# EAGLE board nrfice (EAGLE 9.5.1), part 1 of 2
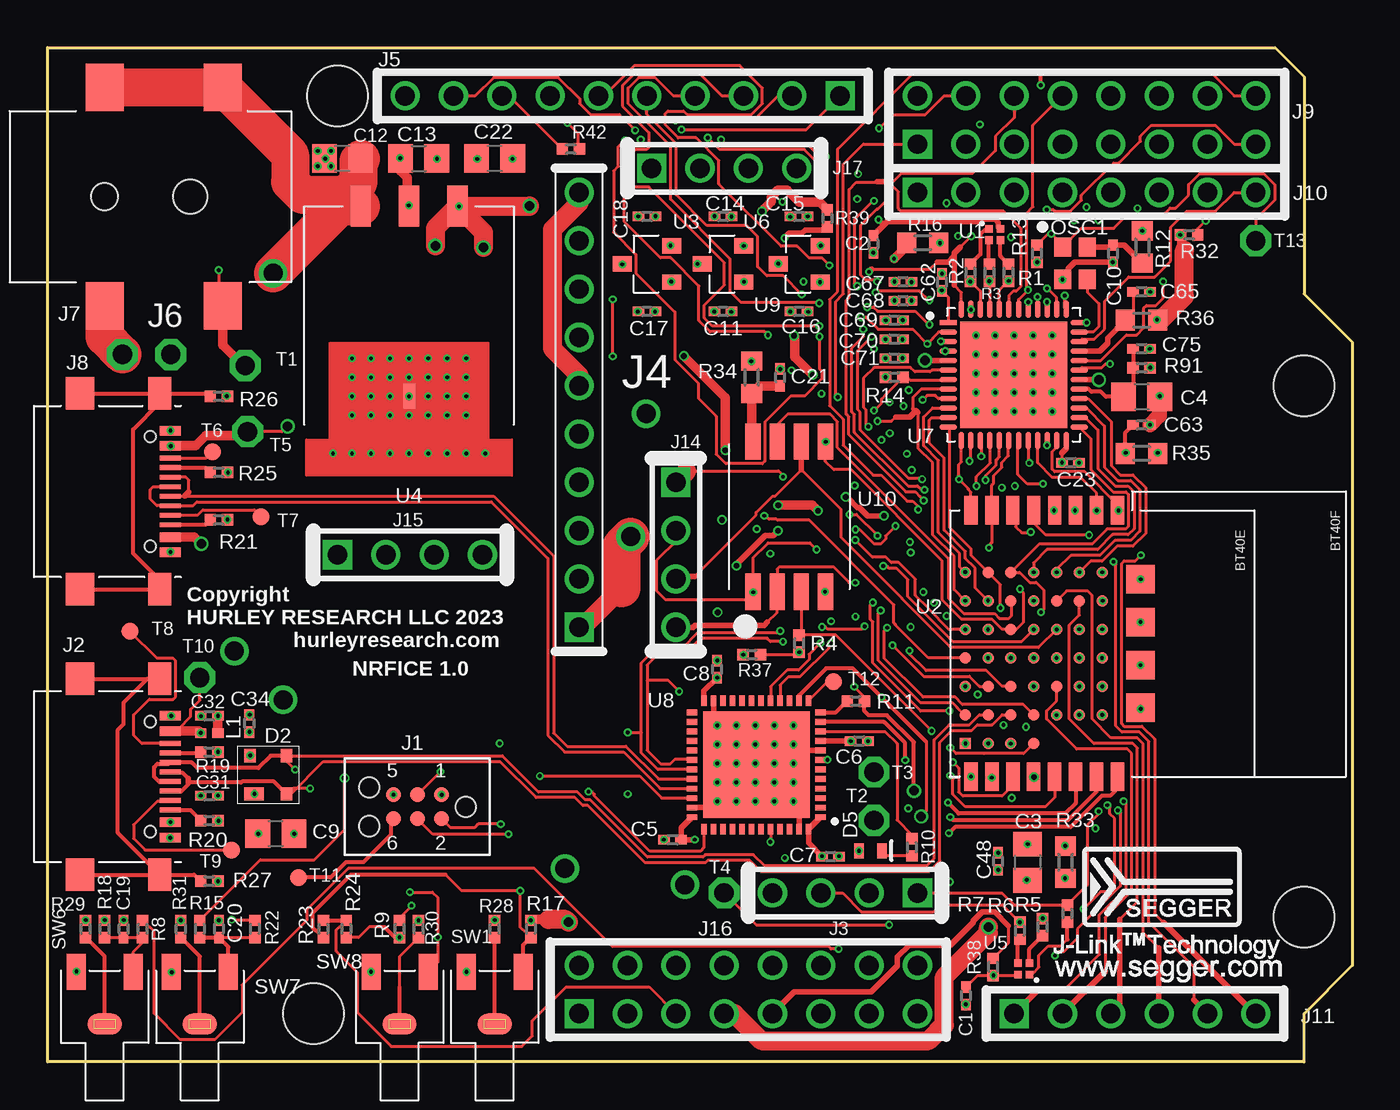
[diagram p4: board, top side]
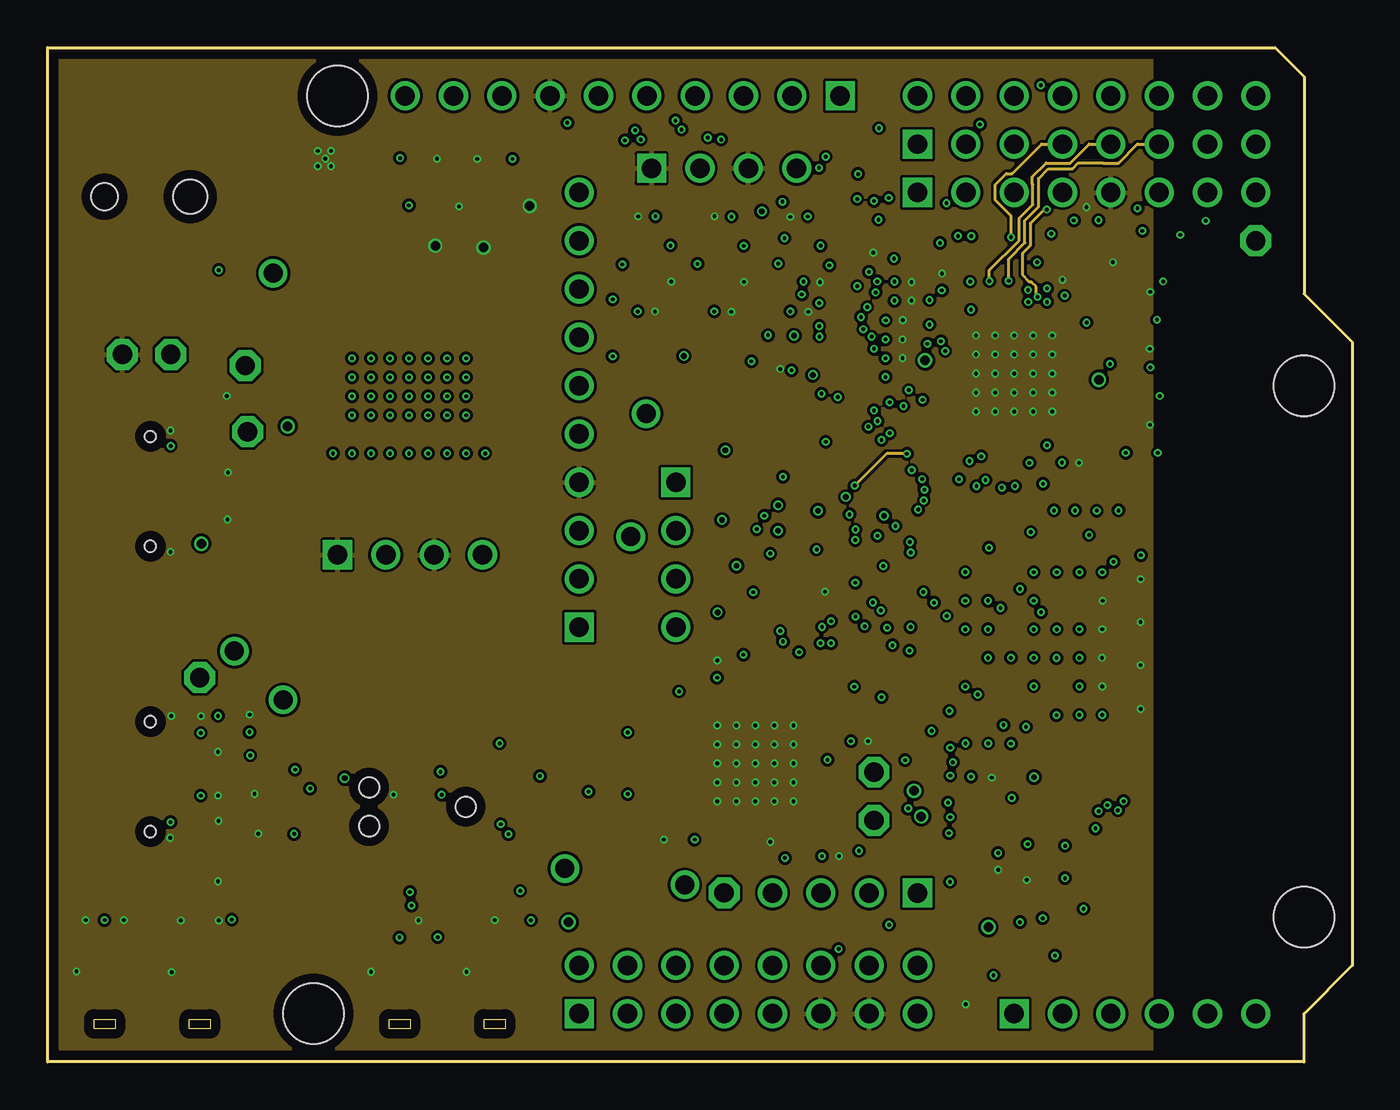
[diagram p5: board, inner layer gnd]
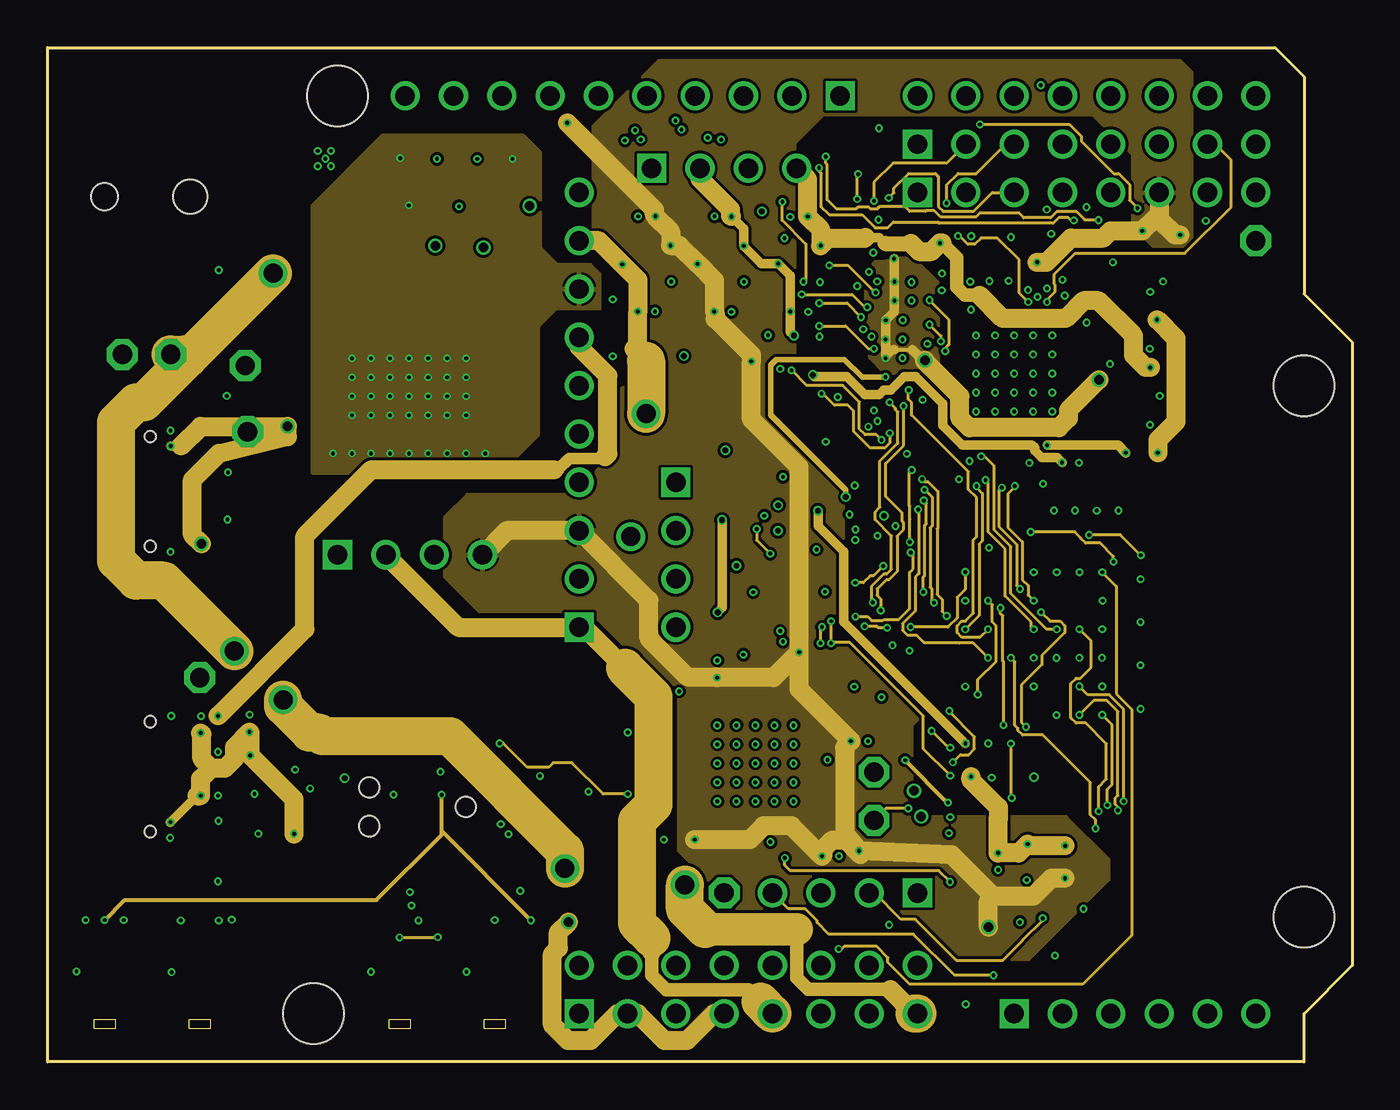
[diagram p6: board, inner layer Route15]
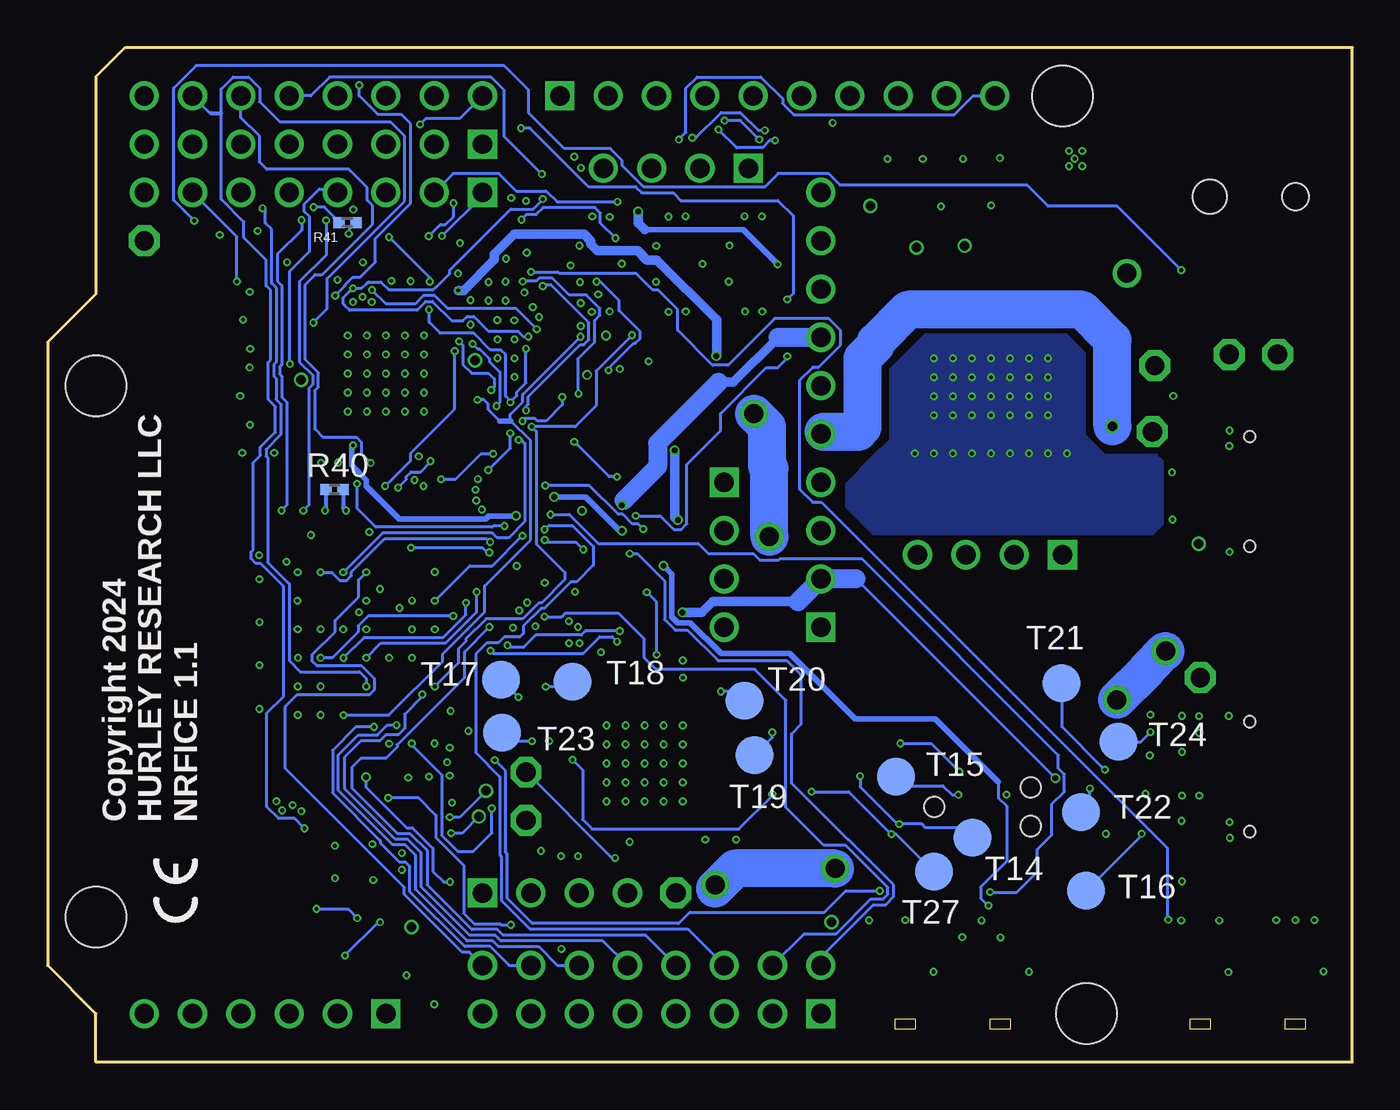
[diagram p7: board, bottom side, seen from below]

Size 68.58 x 53.34 mm. Coordinates in mm from the lower left corner, seen from the top.
Outline: 0,0 0,53.34 64.52,53.34 66.04,51.82 66.04,40.39 68.58,37.85 68.58,5.08 66.04,2.54 66.04,0 0,0
Copper layers (1*2*15*16): Top 0.035mm / dielectric 1.5mm / gnd 0.035mm / dielectric 0.15mm / Route15 0.035mm / dielectric 0.2mm / Bottom 0.035mm
Design rules "oid52840a *": minimum track width 0.15mm, minimum drill 0.2mm, track to track 0.15mm, track to pad 0.15mm, pad to pad 0.15mm, via to via 0.15mm, smd to smd 0mil, copper to edge 0.5mm, drill to drill 0.22mm, minimum pad ring 4mil, minimum via ring 4mil, stop-mask expansion 1mil, vias tented up to drill 15mil, thermal gap 5mil
Holes 3.17 mm at 15.24,50.8 13.97,2.54 66.04,7.62 66.04,35.56

## Footprints (pad centres in the part's own frame; a part is rotated, then mirrored left to right if it is on the bottom)
RCL_C0402 = smd 0.6 x 0.5: 1 -0.45,0; 2 0.45,0
RCL_C0805 = smd 1.3 x 1.5: 1 -0.95,0; 2 0.95,0
PRTR5V0U2X = smd 1 x 0.7: 1GND -0.75,-1 | smd 0.6 x 0.7: 2IO1 0.95,-1; 3IO2 0.95,1; 4VCC -0.95,1
XL-1608SYGC-06 = smd 0.5 x 0.8: A 0.6,0; C -0.6,0
JLINKNEEDLE6 = smd 0.787 x 0.787: 1VTREF 1.27,-0.635; 2SWDIO 1.27,0.635; 3NRESET 2.54,-0.635; 4SWCLK 2.54,0.635; 5GND 3.81,-0.635; 6SWO 3.81,0.635 | hole 1.067: 0,0; 5.08,1.016; 5.08,-1.016
USB-TYPE-C-020 = smd 0.5 x 1.1: A1B12 -3.2,-0.55; A4B9 -2.4,-0.55; B1A12 3.2,-0.55; B4A9 2.4,-0.55 | smd 0.25 x 1.1: A5 -1.25,-0.55; A6 -0.25,-0.55; A7 0.25,-0.55; A8 1.25,-0.55; B5 1.75,-0.55; B6 0.75,-0.55; B7 -0.75,-0.55; B8 -1.75,-0.55 | smd 1.7 x 1.2: S1 -5.15,-1.1; S4 5.15,-1.1 | smd 1.7 x 1.5: S2 -5.15,-5.3; S3 5.15,-5.3 | hole 0.6: -2.89,-1.6; 2.89,-1.6
PZ254V-11-04P = drill 1.02 square: 1 -3.81,0 | drill 1.02: 2 -1.27,0; 3 1.27,0; 4 3.81,0
C57369 = drill 1.02 square: 1 -11.43,0 | drill 1.02: 2 -8.89,0; 3 -6.35,0; 4 -3.81,0; 5 -1.27,0; 6 1.27,0; 7 3.81,0; 8 6.35,0; 9 8.89,0; 10 11.43,0
C35445 = drill 1.02 square: 1 -11.43,0 | drill 1.02: 2 -8.89,0; 3 -6.35,0; 4 -3.81,0; 5 -1.27,0; 6 1.27,0; 7 3.81,0; 8 6.35,0; 9 8.89,0; 10 11.43,0
MTA21 = drill 1.016 pad 1.626 octagon: 1 0,-1.27; 2 0,1.27
DC-050-2.0-B = smd 2 x 2.5: 3GND 5,-5.75; 4GNDSW 11.2,-5.75; 5VINA 11.2,5.75; 5VINB 5,5.75 | hole 1.4: 5,0 | hole 1.8: 9.5,0
C30734 = drill 1.02 square: 1 -8.89,-1.27 | drill 1.02: 2 -8.89,1.27; 3 -6.35,-1.27; 4 -6.35,1.27; 5 -3.81,-1.27; 6 -3.81,1.27; 7 -1.27,-1.27; 8 -1.27,1.27; 9 1.27,-1.27; 10 1.27,1.27; 11 3.81,-1.27; 12 3.81,1.27; 13 6.35,-1.27; 14 6.35,1.27; 15 8.89,-1.27; 16 8.89,1.27
C27438 = drill 1.02 square: 1 -8.89,0 | drill 1.02: 2 -6.35,0; 3 -3.81,0; 4 -1.27,0; 5 1.27,0; 6 3.81,0; 7 6.35,0; 8 8.89,0
C40877 = drill 1.02 square: 1 -6.35,0 | drill 1.02: 2 -3.81,0; 3 -1.27,0; 4 1.27,0; 5 3.81,0; 6 6.35,0
L0402 = smd 0.5 x 0.6: 1 0,0.45; 2 0,-0.45
X1G004171004000 = smd 1 x 0.9: 1OESTN -0.85,-0.65; 2GND 0.85,-0.65; 3OUT 0.85,0.65; 4VCC -0.85,0.65
RCL_R0402 = smd 0.6 x 0.6: 1 -0.45,0; 2 0.45,0
RCL_R0603 = smd 1 x 1.1: 1 -0.85,0; 2 0.85,0
TS-1091C-A8B3-D2 = smd 1 x 1.9: 1 -1.5,2.75; 2 1.5,2.75 | smd 1.8 x 1.1: S 0,0
MTA1 = drill 1.016 pad 1.626 octagon: 1 0,0
T = smd 0.9 x 0.9: T 0,0
T2 = smd 2 x 2: T 0,0
UHD1110-FKA = smd 0.4 x 0.4: 1BLUE -0.3,0.3; 2GREEN -0.3,-0.3; 3RED 0.3,-0.3; 4ANODE 0.3,0.3
BT40F = smd 1.5 x 0.7: 1 0,8.8; 2 0,7.7; 3 0,6.6; 4 0,5.5; 5 0,4.4; 6 0,3.3; 7 0,2.2; 8 0,1.1 | smd 1.499 x 0.711: 9 14,1.1; 10 14,2.2; 11 14,3.3; 12 14,4.4; 13 14,5.5; 14 14,6.6; 15 14,7.7; 16 14,8.8 | smd 0.6 x 0.6: A0 4.75,8; A1 4.75,6.8; A2 4.75,5.6; A3 4.75,4.4; A4 4.75,3.2; A5 4.75,2; A6 4.75,0.8; B0 6.25,8; B1 6.25,6.8; B2 6.25,5.6; B3 6.25,4.4; B4 6.25,3.2; B5 6.25,2; B6 6.25,0.8; C0 7.75,8; C1 7.75,6.8; C2 7.75,5.6; C3 7.75,4.4; C4 7.75,3.2; C5 7.75,2; C6 7.75,0.8; D0 9.25,8; D1 9.25,6.8; D2 9.25,5.6; D3 9.25,4.4; D4 9.25,3.2; D5 9.25,2; D6 9.25,0.8; E0 10.75,8; E1 10.75,6.8; E2 10.75,5.6; E3 10.75,4.4; E4 10.75,3.2; E5 10.75,2; E6 10.75,0.8; F6 12.25,0.8; Z0 3.25,8; Z1 3.25,6.8; Z2 3.25,5.6; Z3 3.25,4.4; Z4 3.25,3.2; Z5 3.25,2; Z6 3.25,0.8 | smd 0.61 x 0.61: F3 12.25,4.4; F4 12.25,3.2; F5 12.25,2 | smd 1.5 x 1.5: H0 3.625,10; H1 5.875,10; H2 8.125,10; H3 10.375,10
ME6211A33M3G-N = smd 0.8 x 1: 1VSS -0.95,-1.3; 2VOUT 0.95,-1.3; 3VIN 0,1.3
LM1085S-5.0 = smd 2.16 x 1.07: 1GND 0,-2.54; 2VOUT 0,0; 3VIN 0,2.54 | smd 1.27 x 0.635: TABVOUT -10,0
ME6206A25XG = smd 0.8 x 1: 1VSS -0.95,-1.1; 2VOUT 0.95,-1.1; 3VIN 0,1.1
ICE40UP5K-SG48I = smd 0.9 x 0.28: 1VCCIO2 -3.45,2.75; 2 -3.45,2.25; 3 -3.45,1.75; 4 -3.45,1.25; 5VCC -3.45,0.75; 6 -3.45,0.25; 7CDONE -3.45,-0.25; 8CRESETB -3.45,-0.75; 9 -3.45,-1.25; 10 -3.45,-1.75; 11 -3.45,-2.25; 12 -3.45,-2.75; 25 3.45,-2.75; 26 3.45,-2.25; 27 3.45,-1.75; 28 3.45,-1.25; 29VCCPLL 3.45,-0.75; 30VCC 3.45,-0.25; 31 3.45,0.25; 32 3.45,0.75; 33VCCIO0 3.45,1.25; 34 3.45,1.75; 35GBIN0 3.45,2.25; 36 3.45,2.75 | smd 0.28 x 0.9: 13 -2.75,-3.45; 14SPISO -2.25,-3.45; 15SPISCK -1.75,-3.45; 16SPISS -1.25,-3.45; 17SPISI -0.75,-3.45; 18 -0.25,-3.45; 19 0.25,-3.45; 20GBIN3 0.75,-3.45; 21 1.25,-3.45; 22SPIVCCIO1 1.75,-3.45; 23 2.25,-3.45; 24VPP2V5 2.75,-3.45; 37GBIN1 2.75,3.45; 38 2.25,3.45; 39RGB2 1.75,3.45; 40RGB1 1.25,3.45; 41RGB0 0.75,3.45; 42 0.25,3.45; 43 -0.25,3.45; 44GBIN6 -0.75,3.45; 45 -1.25,3.45; 46 -1.75,3.45; 47 -2.25,3.45; 48 -2.75,3.45 | smd 5.6 x 5.6: PADDLE 0,0
STM32F072CBU6TR = smd 0.55 x 0.3: 1VBAT -3.375,2.75; 2PC13 -3.375,2.25; 3PC14OSC32IN -3.375,1.75; 4PC15OSC32OUT -3.375,1.25; 5PF0OSCIN -3.375,0.75; 6PF1OSCOUT -3.375,0.25; 7NRST -3.375,-0.25; 8VSSA -3.375,-0.75; 9VDDA -3.375,-1.25; 10PA0 -3.375,-1.75; 11PA1 -3.375,-2.25; 12PA2 -3.375,-2.75; 25PB12 3.375,-2.75; 26PB13 3.375,-2.25; 27PB14 3.375,-1.75; 28PB15 3.375,-1.25; 29PA8 3.375,-0.75; 30PA9 3.375,-0.25; 31PA10 3.375,0.25; 32PA11 3.375,0.75; 33PA12 3.375,1.25; 34PA13SWDIO 3.375,1.75; 35VSS 3.375,2.25; 36VDDIO2 3.375,2.75 | smd 0.3 x 0.55: 13PA3 -2.75,-3.375; 14PA4 -2.25,-3.375; 15PA5 -1.75,-3.375; 16PA6 -1.25,-3.375; 17PA7 -0.75,-3.375; 18PB0 -0.25,-3.375; 19PB1 0.25,-3.375; 20PB2 0.75,-3.375; 21PB10 1.25,-3.375; 22PB11 1.75,-3.375; 23VSS 2.25,-3.375; 24VDD 2.75,-3.375; 37PA14SWDCLK 2.75,3.375; 38PA15 2.25,3.375; 39PB3 1.75,3.375; 40PB4 1.25,3.375; 41PB5 0.75,3.375; 42PB6 0.25,3.375; 43PB7 -0.25,3.375; 44BOOT0 -0.75,3.375; 45PB8 -1.25,3.375; 46PB9 -1.75,3.375; 47VSS -2.25,3.375; 48VDD -2.75,3.375 | smd 5.6 x 5.6: EP 0,0
HX6306P122MR = smd 0.8 x 1: 1VSS -0.95,-1.1; 2VOUT 0.95,-1.1; 3VIN 0,1.1
AT25SF128A-SHB-T = smd 1.9 x 0.8: 1CSN -3.95,1.905; 2SOIO1 -3.95,0.635; 3WPNIO2 -3.95,-0.635; 4GND -3.95,-1.905; 5SIIO0 3.95,-1.905; 6SCK 3.95,-0.635; 7HOLDNIO3 3.95,0.635; 8VCC 3.95,1.905

## Placement (x,y rotation side)
C1  DNL  [RCL_C0402]  48.26,3.48 270 top
C2  DNL  [RCL_C0402]  43.4,43 270 top
C3  10uF  [RCL_C0805]  51.5,10.5 270 top
C4  10uF  [RCL_C0805]  57.5,34.98 0 top
C5  1uF  [RCL_C0402]  32.85,11.69 180 top
C6  0.1uF  [RCL_C0402]  42.66,16.87 0 top
C7  0.1uF  [RCL_C0402]  41.15,10.81 0 top
C8  0.1uF  [RCL_C0402]  35.19,20.65 90 top
C9  10uF  [RCL_C0805]  12,12 180 top
C10  0.01uF  [RCL_C0402]  56,42.5 270 top
C11  1uF  [RCL_C0402]  35.5,39.46 0 top
C12  22uF  [RCL_C0805]  15.5,47.5 180 top
C13  10uF  [RCL_C0805]  19.5,47.5 0 top
C14  1uF  [RCL_C0402]  35.5,44.46 180 top
C15  1uF  [RCL_C0402]  39.5,44.46 180 top
C16  1uF  [RCL_C0402]  39.5,39.46 0 top
C17  1uF  [RCL_C0402]  31.5,39.46 0 top
C18  1uF  [RCL_C0402]  31.5,44.46 180 top
C19  1uF  [RCL_C0402]  4,7 90 top
C20  1uF  [RCL_C0402]  9,7 90 top
C21  1uF  [RCL_C0402]  38.5,36 90 top
C22  22uF  [RCL_C0805]  23.5,47.5 180 top
C23  1uF  [RCL_C0402]  53.77,31.51 0 top
C31  0.01uF  [RCL_C0402]  8.5,14 0 top
C32  0.1uF  [RCL_C0402]  8.5,18.2 180 top
C34  0.1uF  [RCL_C0402]  10.6,17.8 90 top
C48  0.1uF  [RCL_C0402]  49.96,10.55 270 top
C62  0.1uF  [RCL_C0402]  47,41 90 top
C63  0.1uF  [RCL_C0402]  57.5,33.5 0 top
C65  0.1uF  [RCL_C0402]  57.5,40.5 0 top
C67  0.1uF  [RCL_C0402]  44.96,41.02 0 top
C68  1uF  [RCL_C0402]  44.96,40.02 0 top
C69  0.01uF  [RCL_C0402]  44.5,39 0 top
C70  0.1uF  [RCL_C0402]  44.5,38 0 top
C71  1uF  [RCL_C0402]  44.5,37 0 top
C75  0.1uF  [RCL_C0402]  57.5,37.5 0 top
D2  PRTR5V0U2X  [PRTR5V0U2X]  11.6,15.1 0 top
D5  XL-1608SYGC-06  [XL-1608SYGC-06]  43.25,11.1 180 top
J1  JLINKNEEDLE6  [JLINKNEEDLE6]  21.98,13.42 180 top
J2  USB-TYPE-C-020  [USB-TYPE-C-020]  7,15 270 top
J3  PZ254V-11-04P  [PZ254V-11-04P]  41.91,8.89 180 top
J4  C57369  [C57369]  27.94,34.29 90 top
J5  C35445  [C35445]  30.23,50.8 180 top
J6  MTA21  [MTA21]  5.2,37.2 270 top
J7  DC-050-2.0-B  [DC-050-2.0-B]  -2,45.5 0 top
J8  USB-TYPE-C-020  [USB-TYPE-C-020]  7,30 270 top
J9  C30734  [C30734]  54.61,49.53 0 top
J10  C27438  [C27438]  54.61,45.72 0 top
J11  C40877  [C40877]  57.15,2.54 0 top
J14  PZ254V-11-04P  [PZ254V-11-04P]  33.02,26.67 270 top
J15  PZ254V-11-04P  [PZ254V-11-04P]  19.05,26.67 0 top
J16  C30734  [C30734]  36.83,3.81 0 top
J17  PZ254V-11-04P  [PZ254V-11-04P]  35.56,46.99 0 top
L1  FB 120R 0.55A  [L0402]  8.5,17.3 90 top
OSC1  X1G004171004000  [X1G004171004000]  54,42 270 top
R1  1K  [RCL_R0402]  50.5,41.5 90 top
R2  680  [RCL_R0402]  48.5,41.5 90 top
R3  680  [RCL_R0402]  49.5,41.5 90 top
R4  DNL  [RCL_R0402]  39.5,22 270 top
R5  680  [RCL_R0402]  53.6,7.8 270 top
R6  680  [RCL_R0402]  52.3,7.1 270 top
R7  1K  [RCL_R0402]  51.1,6.9 270 top
R8  100  [RCL_R0402]  5,7 270 top
R9  10K  [RCL_R0402]  18.5,7 90 top
R10  470  [RCL_R0402]  45.43,11.29 90 top
R11  220  [RCL_R0402]  42.48,18.98 180 top
R12  0  [RCL_R0603]  57.54,42.85 90 top
R13  10K  [RCL_R0402]  52,42.5 270 top
R14  10K  [RCL_R0402]  44.5,36 180 top
R15  10K  [RCL_R0402]  8,7 90 top
R16  1  [RCL_R0603]  46,43.07 0 top
R17  100K  [RCL_R0402]  25.4,7 90 top
R18  10K  [RCL_R0402]  3,7 90 top
R19  5.1K  [RCL_R0402]  8.5,16.3 180 top
R20  5.1K  [RCL_R0402]  8.5,12.7 180 top
R21  5.1K  [RCL_R0402]  9,28.5 180 top
R22  100  [RCL_R0402]  10.9,7 270 top
R23  DNL  [RCL_R0402]  14.5,7 90 top
R24  0  [RCL_R0402]  15.7,7 90 top
R25  5.1K  [RCL_R0402]  9,31 180 top
R26  DNL  [RCL_R0402]  9,35 180 top
R27  DNL  [RCL_R0402]  8.5,9.5 180 top
R28  10K  [RCL_R0402]  23.5,7 270 top
R29  10K  [RCL_R0402]  2,7 270 top
R30  10K  [RCL_R0402]  19.5,7 270 top
R31  10K  [RCL_R0402]  7,7 270 top
R32  DNL  [RCL_R0402]  60,43.5 180 top
R33  0  [RCL_R0603]  53.5,10.5 270 top
R34  1  [RCL_R0603]  37,36 90 top
R35  1  [RCL_R0603]  57.5,32 0 top
R36  1  [RCL_R0603]  57.5,39 0 top
R37  10K  [RCL_R0402]  37.01,21.42 180 top
R38  0  [RCL_R0402]  49.7,5 90 top
R39  0  [RCL_R0402]  40.98,44.36 90 top
R40  DNL  [RCL_R0402]  53.5,30.1 0 bottom
R41  DNL  [RCL_R0402]  52.82,44.13 0 bottom
R42  5.1K  [RCL_R0402]  27.5,48 0 top
R91  100  [RCL_R0402]  57.5,36.5 0 top
SW1  TS-1091C-A8B3-D2  [TS-1091C-A8B3-D2]  23.5,2 0 top
SW6  TS-1091C-A8B3-D2  [TS-1091C-A8B3-D2]  3,2 0 top
SW7  TS-1091C-A8B3-D2  [TS-1091C-A8B3-D2]  8,2 0 top
SW8  TS-1091C-A8B3-D2  [TS-1091C-A8B3-D2]  18.5,2 0 top
T1  MTA1  [MTA1]  10.39,36.62 0 top
T2  MTA1  [MTA1]  43.43,12.7 0 top
T3  MTA1  [MTA1]  43.43,15.24 0 top
T4  MTA1  [MTA1]  35.56,8.89 0 top
T5  MTA1  [MTA1]  10.51,33.14 0 top
T6  T  [T]  8.66,32.08 0 top
T7  T  [T]  11.23,28.68 0 top
T8  T  [T]  4.33,22.65 0 top
T9  T  [T]  9.66,11.15 0 top
T10  MTA1  [MTA1]  8,20.21 0 top
T11  T  [T]  13.2,9.7 0 top
T12  T  [T]  41.3,20 0 top
T13  MTA1  [MTA1]  63.5,43.18 0 top
T14  TT2  [T2]  19.96,11.8 0 bottom
T15  TT2  [T2]  24,15 0 bottom
T16  TT2  [T2]  14,9 0 bottom
T17  TT2  [T2]  44.75,20.09 0 bottom
T18  TT2  [T2]  41,20 0 bottom
T19  TT2  [T2]  31.42,16.13 0 bottom
T20  TT2  [T2]  31.94,19 0 bottom
T21  TT2  [T2]  15.28,19.91 0 bottom
T22  TT2  [T2]  14.27,13.14 0 bottom
T23  TT2  [T2]  44.7,17.31 0 bottom
T24  TT2  [T2]  12.29,16.84 0 bottom
T27  TT2  [T2]  22,10 0 bottom
U1  UHD1110-FKA  [UHD1110-FKA]  49.78,43.51 0 top
U2  BT40F  [BT40F]  47.43,29 270 top
U3  ME6211A33M3G-N  [ME6211A33M3G-N]  31.5,41.96 90 top
U4  LM1085S-5.0  [LM1085S-5.0]  19,45 90 top
U5  UHD1110-FKA  [UHD1110-FKA]  51.3,4.9 180 top
U6  ME6206A25XG  [ME6206A25XG]  35.5,41.96 90 top
U7  ICE40UP5K-SG48I  [ICE40UP5K-SG48I]  50.78,36.13 0 top
U8  STM32F072CBU6TR  [STM32F072CBU6TR]  37.25,15.63 180 top
U9  HX6306P122MR  [HX6306P122MR]  39.5,41.96 90 top
U10  AT25SF128A-SHB-T  [AT25SF128A-SHB-T]  38.98,28.68 90 top

## Tracks (layer width: path | path; a pad name or v marks a point on that pad's centre or on a via)
1V2  (via drill 0.2)
  Top 0.15: R16.2 v46.9,43.06
  Top 0.2: R91.2 v57.96,36.52 | U9.2VOUT v40.64,42.91 v40.63,42.92
  Route15 0.5: 42.98,43.35 43.71,43.35 44.02,43.04
  Route15 0.7: 48.98,40.32 48.97,40.33 48.2,40.33 47.79,40.74 47.79,42.28 47.01,43.06
  Route15 0.8: 44.02,43.04 45.38,43.04
  Route15 1: v57.96,36.52 57.71,36.52 57.08,37.15 57.08,38.18 55.23,40.03 54.44,40.03 53.5,39.09 50.21,39.09 48.98,40.32 | 45.38,43.04 45.81,42.61 46.45,42.61 v46.9,43.06 47.01,43.06 | J17.4 39.95,46.41 C15.1 40.63,43.78 v40.63,42.92 41.02,43.31 42.95,43.31 42.98,43.35
  other vias: 39.95,44.46
2V5  (via drill 0.2, 0.3)
  Top 0.15: C16.1 v39.04,39.46 | 53.29,32.01 53.29,31.54 C23.1 v53.32,31.52
  Top 0.2: C14.1 v35.95,44.45 | U6.2VOUT v36.59,42.91 | U9.3VIN v38.4,41.98
  Top 0.3: U7.24VPP2V5 53.53,32.25 53.29,32.01
  Top 0.5: v40.22,36.12 39.27,37.07 39.27,38.15 v39.23,38.19
  Route15 0.5: v35.95,44.45 36.59,43.81 v36.59,42.91 37.52,41.98 v38.4,41.98 39.04,41.34 v39.04,39.46 39.04,38.38 v39.23,38.19 | v40.22,36.12 40.29,36.05 42,36.05 42.96,35.09 43.7,35.09 43.95,35.34 44.32,35.34 45.02,36.04 45.64,36.04 47.05,34.63 47.05,33.47 48.07,32.45 51.73,32.45 51.88,32.3 51.88,32.16 52.26,31.78 53.06,31.78 v53.32,31.52
  Route15 1: v35.95,44.45 35.9,44.5 35.9,44.82 34.29,46.43 J17.2
3V3  (via drill 0.2, 0.5)
  Top 0.15: R37.1 39.37,21.42 R4.2 | R42.2 27.9,48.05 27.9,48.8 v27.32,49.38
  Top 0.2: R18.2 v3,7.46 | R33.2 v53.47,9.66 | J1.1VTREF | R32.2 v59.54,43.5 v59.53,43.49 | R36.2 v58.31,39.03 | R35.2 v58.35,32.03 | U6.3VIN 34.19,41.97 v34.16,41.97 | v32.74,42.93 32.78,42.93 U3.2VOUT | R34.2 v36.99,36.84 | R13.2 v52.01,42.05 | C18.1 v31.95,44.47 | C8.1 v35.19,20.21 | C11.1 v35.04,39.46
  Top 0.3: C8.1 34.5,19.51 U8.24VDD | U8.9VDDA C6.1 v42.22,16.87 | U8.1VBAT U8.48VDD 40,11.51 C7.1 v40.7,10.82 | U8.36VDDIO2 33.3,12.3 C5.1 v34.01,11.69
  Top 0.5: 59.75,42.68 59.61,42.82 59.61,43.44 R32.2 | 26.33,7.5 25.45,7.5 R17.2
  Top 1: R36.2 58.4,39.05 58.55,39.05 59.75,40.26 59.75,42.68 | J16.7 36.1,2.54 37.51,1.12 46.31,1.12 47.13,1.95 47.13,4.47 49.45,6.79 v49.45,7.09 | v27.38,7.35 27.23,7.5 26.33,7.5
  Route15 0.15: v27.32,49.38
  Route15 0.2: v3,7.46 4.06,8.52 17.28,8.52 20.71,11.95 J1.1VTREF 20.71,12.14 R17.2
  Route15 1: v52.01,42.05 52.51,42.05 53.78,43.32 55.49,43.32 55.87,43.7 R12.2 58.17,44.33 58.42,44.33 | v58.35,32.03 58.35,32.71 59.3,33.66 59.3,38.04 v58.31,39.03 | v53.47,9.66 52.75,9.66 51.81,8.72 49.7,8.72 | D5.A 47.52,10.9 49.7,8.72 | D5.A 42.72,10.9 41.95,11.67 41.25,11.67 40.75,11.17 40.75,10.87 v40.7,10.82 39.1,12.42 37.64,12.42 36.91,11.69 v34.01,11.69 | D5.A 41.89,12.01 41.89,16.54 v42.22,16.87 39.5,19.59 R4.2 | R4.2 38.16,20.21 v35.19,20.21 35.14,20.26 33.62,20.26 31.61,22.27 31.61,24.27 J4.3 24.13,27.94 J15.4 | R4.2 39.5,31.29 36.99,33.8 v36.99,36.84 36.99,37.19 35.09,39.09 35.09,39.41 v35.04,39.46 35.04,41.09 v34.16,41.97 33.2,42.93 v32.74,42.93 32.74,43.68 v31.95,44.47 31.89,44.53 31.89,44.81 v27.32,49.38 | J10.6 58.42,44.33 | 58.42,44.33 59.26,43.49 v59.53,43.49 | v49.45,7.09 49.45,8.47 49.7,8.72 | J16.7 35.02,2.54 33.61,1.12 32.43,1.12 31.02,2.54 J16.3 29.94,2.54 28.53,1.12 27.35,1.12 26.52,1.95 26.52,5.67 26.85,5.99 26.85,6.82 v27.38,7.35
  Bottom 0.15: J1.1VTREF 21.04,14.05 21.52,14.53 23.53,14.53 T15.T
  other vias: 20.71,14.05 25.4,7.45 42.65,11.1 39.5,21.55 57.54,43.7
  pour Route15: 60.15,42.9 60.15,52.05 59.25,52.95 32.4,52.95 28.65,49.2 28.65,43.8 31.35,41.1 31.35,36.6 30,35.25 30,32.25 27.6,29.85 22.05,29.85 20.85,28.65 20.85,25.5 22.65,23.7 28.5,23.7 33.15,19.05 33.15,11.1 38.85,5.4 51.6,5.4 55.8,9.6 55.8,10.65 53.55,12.9 45.45,12.9 45.45,17.7 46.2,18.45 41.85,22.8 41.85,32.4 39.3,34.95 39.3,48.3 40.8,49.8 54.9,49.8 57,47.7 57,43.95 58.05,42.9
5V  (via drill 0.2, 0.3, 1)
  Top 0.15: 50.5,7.17 50.5,6.25 R38.2
  Top 0.2: C17.1 v31.02,39.46 | U3.3VIN v30.21,41.95 v30.21,41.94
  Top 0.3: 50.5,7.17 49.78,7.89 49.12,7.89 48.65,7.42 48.65,7.34 47.45,6.14 45.28,6.14 44.66,5.52 44.66,5.05 43.29,3.68 39.24,3.68 J16.9
  Top 0.5: R39.2 40.58,45.21 39.5,45.21 38.88,45.83 38.38,45.83 38.03,45.48 38.03,45.23 v37.53,44.73 v37.54,44.72
  Top 1: 30.16,24.91 28.11,22.86 J4.1
  Top 2: v30.65,27.62 30.16,27.12 30.16,24.91
  Route15 0.7: 31.75,5.81 31.75,4.56 32.51,3.81 36.84,3.81 37.48,3.17
  Route15 1: 31.46,36.88 30.83,37.51 31.02,37.7 v31.02,39.46 31.02,41.13 v30.21,41.94 28.97,43.18 J4.9 | 31.75,6.52 31.75,5.81 | J15.2 21.59,22.86 J4.1 28.2,22.86 30.34,20.72
  Route15 2: 31.46,36.88 v31.46,34.09 | 30.34,20.72 31.84,19.22 31.84,13.53 30.97,12.66 30.97,7.3 31.75,6.52 | 37.48,3.17 J16.9
  Bottom 0.3: v30.21,41.94 32.03,43.76 37.19,43.76
  Bottom 0.5: v37.54,44.72 37.54,44.11 37.19,43.76
  Bottom 2: v30.65,27.62 30.65,31.23 30.76,31.34 30.76,33.39 v31.46,34.09
5VREG  (via drill 0.2)
  Top 0.2: C13.1 v18.53,47.52 v18.53,47.53 | C22.1 v24.44,47.48 | U4.2VOUT v18.99,45.04
  Top 0.5: U4.2VOUT 18.9,45.1 18.9,46.49 18.55,46.84 C13.1
  other vias: 16,37 17,37 18,37 19,37 20,37 21,37 22,37 22,36 21,36 20,36 19,36 18,36 17,36 16,36 16,35 17,35 18,35 19,35 20,35 21,35 22,35 22,34 21,34 20,34 19,34 18,34 17,34 16,34 22,32 23,32 21,32 20,32 19,32 18,32 17,32 16,32 15,32
  pour Route15: 13.9,31 23.8,31 25.8,33 25.8,38.7 26.73,39.63 29.03,39.63 29.03,41.4 28.53,41.9 26.8,41.9 25.9,42.8 25.9,47.8 25,48.7 17.6,48.7 13.9,45
  pour Bottom: 12.4,31.9 13,31.9 14.1,33 14.1,37.3 15,38.2 22.5,38.2 24.3,36.4 24.3,32.7 25.2,31.8 26.6,30.4 26.6,29.2 25.2,27.8 13,27.8 10.5,27.8 10,28.3 10,31.6 10.3,31.9
9V  (via drill 1)
  Top 0.15: C12.1
  Top 1: U4.3VIN C12.1
  Top 2: v11.86,41.47 15.39,45 U4.3VIN | J7.5VINB J7.5VINA 12.75,47.7 12.75,46.27 13.42,45.6 15.68,45.6 16.35,46.27 16.35,47.38 C12.1
  Route15 0.7: 39.37,6.98 39.37,4.43 39.99,3.81 44.29,3.81
  Route15 1: 45.56,2.54 44.29,3.81
  Route15 1.7: 39.37,6.98 34.56,6.98
  Route15 2: v12.38,19.04 12.38,18.71 13.77,17.32 14.27,17.32 14.45,17.14 21.14,17.14 27.19,11.09 v27.19,10.17 | v9.82,21.6 6.11,25.31 4.65,25.31 3.6,26.36 3.6,33.64 4.65,34.69 5.08,34.69 7.39,37.01 | 7.39,37.01 v11.86,41.47 | 34.56,6.98 33.49,8.04 v33.49,9.31 | J16.15 45.56,2.54 | J6.2 7.2,37.2 7.39,37.01
  Bottom 0.15: v33.49,9.31 33.51,9.3 33.51,9.11
  Bottom 2: v27.19,10.17 32.44,10.17 33.51,9.11 | v12.38,19.04 10.77,20.65 10.77,20.69 9.86,21.6 v9.82,21.6
9VINGNDSW  (via drill 0.2)
  Top 0.15: R32.1 60.45,43.81 v60.87,44.23 | v9,41.64 9,39.95 J7.4GNDSW
  Top 0.5: J7.4GNDSW 9.2,37.7 10.28,36.62 T1.1
  Bottom 0.15: v60.87,44.23 61.37,44.73 | 61.37,44.73 | 61.37,44.73 61.95,45.31 61.95,51.21 60.77,52.39 44.59,52.39 43.3,51.1 43.3,49.9 41.43,48.03 39.01,48.03 38.38,47.4 38.38,47.14 37.24,46 30.89,46 30.18,46.71 27.53,46.71 26.92,46.1 17.1,46.1 16,45 12.36,45 v9,41.64
ARD_D2  (via drill 0.2)
  Top 0.15: U7.20GBIN3 51.53,31.57 v51.6,31.5
  Bottom 0.15: J9.12 58.42,49.66 57.43,48.67 57.43,47.3 57.07,46.94 52.75,46.94 51.79,45.98 51.79,45.31 51.5,45.02 51.5,44.04 54.14,41.4 54.51,41.4 55.04,40.88 55.04,36.93 54.35,36.24 54.35,35.5 54.55,35.3 54.55,33.3 54.11,32.86 52.35,32.86 52.1,32.61 52.1,32 v51.6,31.5
ARD_D3  (via drill 0.2)
  Top 0.15: v45.96,30.64 45.91,30.7 45.24,30.7 42.71,33.23 42.71,34.17 42.57,34.31 42.57,37.4 v43.31,38.14 | v52.53,40.68 52.55,40.68 53.03,40.2 U7.38
  Route15 0.15: v45.96,30.64 46.09,30.52 46.27,30.52 46.79,30 46.79,28.06 46.76,28.03 46.76,24.59 47.02,24.32 47.02,23.69 v47.26,23.45 | v42.55,45.37 42.55,46.64 v42.6,46.69
  Bottom 0.15: U2.C1 53.62,21.25 52.26,22.62 52.26,22.93 51.73,23.45 v47.26,23.45 | v43.31,38.14 43.58,38.14 43.86,38.43 45.42,38.43 45.92,38.93 45.92,38.95 46.17,39.2 46.53,39.2 46.75,38.97 47.34,38.97 48.35,39.99 48.71,39.99 49.16,39.53 52.7,39.53 52.96,39.78 52.96,39.79 53.03,39.86 53.03,40.18 v52.53,40.68 52.07,40.68 51.79,40.96 51.76,40.96 51.71,41.02 51.06,41.02 50.65,40.6 48.31,40.6 48.2,40.72 48.17,40.72 47.44,41.45 47.44,41.64 44.23,44.85 43.04,44.85 42.55,45.34 v42.55,45.37 | v42.6,46.69 44.6,48.69 44.6,51.12 45.27,51.79 53.75,51.79 54.74,50.8 J9.10
  other vias: 54.23,21.25
ARD_D4  (via drill 0.2)
  Top 0.15: v46.09,30.09 45.91,30.09 45.72,30.29 45.23,30.29 42.41,33.1 42.41,34.05 42.27,34.19 42.27,37.55 42.87,38.15 v42.87,38.53 | U2.C2 v53.03,21.24 | J9.8 51.79,49.25 51.79,44.97 51.47,44.65 51.47,40.66 v51.53,40.59 51.03,40.09 U7.42
  Route15 0.15: v46.09,30.09 46.49,29.7 46.49,28.19 46.39,28.09 46.39,24.96 46.46,24.89 46.46,24.28 v46.59,24.15
  Bottom 0.15: v46.59,24.15 46.59,23.51 47.78,22.32 51.95,22.32 v53.03,21.24 | v42.87,38.53 43.94,39.6 47.55,39.6 48.23,40.29 48.83,40.29 49.27,39.85 50.79,39.85 v51.53,40.59
ARD_D5  (via drill 0.2)
  Top 0.15: v46.05,29.52 45.84,29.73 45.84,29.74 45.59,29.99 45.1,29.99 42.11,32.98 42.11,33.92 41.97,34.06 41.97,40.04 42.12,40.19 42.12,45.88 42.51,46.26 43.63,46.26 43.6,46.29 | U7.43 50.52,40.3 50.74,40.52 50.9,40.52 51.13,40.76 51.13,43.84 50.24,44.73 44.86,44.73 44.72,44.87 44.72,45.76 44.19,46.29 44.44,46.29 44.86,46.71 48.61,46.71 49.81,47.91 49.81,48.67 50.8,49.66 J9.6
  Top 0.3: 44.19,46.29 43.6,46.29
  Route15 0.15: v46.03,24.71 46.03,25.5 46.09,25.56 46.09,28.21 46.19,28.31 46.19,29.38 v46.05,29.52
  Bottom 0.15: v46.03,24.71 46.03,23.65 47.66,22.02 51.06,22.02 U2.C3
  other vias: 51.83,21.25
ARD_D8  (via drill 0.2)
  Top 0.15: U2.E2 v53.03,18.24 | U7.9 46.83,34.88 46.66,35.05 46.22,35.05 v45.99,34.82 | v40.57,38.14 40.57,36.44 40.7,36.32 40.7,35.92 39.8,35.02 39.07,35.02 37.7,33.65 37.7,31.59 37.57,31.45 35.65,31.45 35.14,31.96 35.14,33.96 34.2,34.9 34.2,35.69 32.96,36.92 32.96,39.44 30.93,41.48 30.93,42.45 29.75,43.63 29.75,46.85 30,47.1 30,48.12 v30.34,48.46 | v33.32,49.03 39.88,49.03 J5.1
  Bottom 0.15: v40.57,38.14 43.61,35.1 43.61,34.71 44.27,34.05 44.27,33.72 | 44.81,33.71 45.42,34.31 45.42,34.59 45.65,34.82 v45.99,34.82 | v53.03,18.24 50.65,18.24 47.81,21.07 47.81,21.45 45.6,23.65 45.6,25.04 43.19,27.45 43.19,32.67 44.23,33.71 | v30.34,48.46 30.61,48.46 31,48.07 32.37,48.07 v33.32,49.03
  Bottom 0.3: 44.28,33.71 44.81,33.71 | 44.28,33.71 44.27,33.72 | 44.23,33.71 44.28,33.71
ARD_D9  (via drill 0.2)
  Top 0.15: U7.6 46.46,36.38 46.37,36.29 45.58,36.29 45.34,36.52 43.44,36.52 42.87,35.96 42.87,34.44 43.01,34.3 43.01,33.54 v43.14,33.41 | U2.D6 v48.23,19.74 | v37.86,38.22 37.68,38.4 34.82,38.4 34.23,38.99 34.23,40.8 32.74,42.28 32.21,42.28 30.3,44.19 30.3,46.7 30.3,46.8 30.3,47.81 30.77,48.28 30.95,48.28 v31.17,48.5 | J5.2 38.4,50.8 37.11,49.51 v33.01,49.51 v33,49.5
  Bottom 0.15: v48.23,19.74 46.97,21 46.97,21.75 46.6,22.11 46.6,22.23 45.54,23.3 43.61,23.3 42.76,24.15 42.62,24.15 41.39,25.38 41.39,25.74 42.89,27.24 42.89,33.16 v43.14,33.41 40.84,33.41 39.74,34.5 39.74,36.33 v37.86,38.22 | v31.17,48.5 32.17,49.5 v33,49.5
ARD_D10SS  (via drill 0.2)
  Top 0.15: U2.11 50.71,14.98 50.71,14.52 50.17,13.98 48.1,13.98 47.88,14.2 47.88,15.46 v47.58,15.76 | v47.4,18.45 45.89,18.45 43.37,20.98 43.37,23.14 43.24,23.27 43.24,24.03 v43.38,24.16 | U7.47 v48.53,39.56 | v40.56,38.7 34.95,38.7 34.52,39.12 34.52,39.8 35.58,40.85 35.58,42.02 31.6,46 30.89,46 30.6,46.29 30.6,47.69 30.89,47.98 31.48,47.98 31.6,48.1 31.6,48.87 30.21,50.27 30.21,51.33 30.96,52.09 34.15,52.09 35.44,50.8 J5.3
  Route15 0.15: v47.58,15.76 47.98,16.16 48.41,16.16 48.72,16.46 48.72,17.11 47.4,18.43 v47.4,18.45 | v44.26,34.69 44.56,34.38 44.56,34.31 44.69,34.19 44.69,32.54 43.75,31.6 43.75,29.18 43.49,28.92 43.49,28.52 44.35,27.66 44.35,25.9 44.1,25.65 43.96,25.65 43.3,25 43.3,24.23 v43.38,24.16 | v40.56,38.7 41.94,38.7 43.13,37.51 v43.44,37.51
  Bottom 0.15: v48.53,39.56 48.53,38.9 47.95,38.32 46.19,38.32 45.31,37.44 44.75,37.44 44.5,37.19 44.5,35 44.26,34.76 v44.26,34.69 43.91,35.03 43.91,35.22 43.44,35.7 v43.44,37.51
ARD_D11MOSI  (via drill 0.2)
  Top 0.15: U2.E6 48.2,18.25 47.82,18.63 47.57,18.88 45.89,18.88 43.67,21.1 43.67,23.62 v43.79,23.74 | U7.2 46.84,38.38 46.52,38.07 46.52,38.04 v46.24,37.76 45.48,38.52 43.66,38.52 43.01,39.17 v42.75,39.17 | v40.55,39.9 40.38,39.9 40.34,39.94 36.46,39.94 35.88,40.52 35.88,42.23 32.74,45.36 32.74,48.16 30.51,50.39 30.51,51.21 31.09,51.79 31.91,51.79 32.9,50.8 J5.4
  Route15 0.15: v40.55,39.9 42.02,39.9 v42.75,39.17 | v44.99,34.49 44.99,32.41 44.05,31.48 44.05,29.73 44.91,28.87 44.91,28.44 45,28.36 45,28 44.65,27.65 44.65,25.78 44.22,25.35 44.08,25.35 43.6,24.87 43.6,24.54 43.8,24.34 43.8,23.98 43.79,23.97 v43.79,23.74
  Bottom 0.15: v46.24,37.76 45.97,37.49 45.87,37.49 45.36,36.98 45.36,36.83 44.8,36.28 44.8,34.67 v44.99,34.49
ARD_D12MISO  (via drill 0.2)
  Top 0.15: U7.3 v46.96,37.88 v46.95,37.89 | v43.08,39.69 43.41,39.69 43.62,39.48 45.59,39.48 46.3,38.77 v46.35,38.77 | v39.64,40.36 38.67,41.34 37.81,41.34 37.33,41.82 37.33,43.4 36.74,43.98 34.66,43.98 33.04,45.6 33.04,48.28 31.5,49.82 J5.5
  Route15 0.15: U2.B5 49,22.32 48.05,22.32 47.8,22.57 47.8,22.93 48.05,23.18 48.23,23.18 48.66,23.6 48.66,27.45 48.83,27.62 48.83,29.67 48.39,30.1 48.39,31.04 45.42,34.01 45.42,34.66 45.23,34.85 45.23,35.29 v45.26,35.33 | v39.64,40.36 42.29,40.36 42.96,39.69 v43.08,39.69 | v46.35,38.77 46.95,38.17 v46.95,37.89
  Bottom 0.15: v46.95,37.89 46.75,37.69 46.75,36.67 46.3,36.22 45.41,36.22 45.1,35.91 45.1,35.49 v45.26,35.33
  other vias: 49.43,22.75
ARD_D13SCK  (via drill 0.2)
  Top 0.15: U7.4 v47.18,37.38 | v43.52,40.46 43.6,40.55 45.81,40.55 46.3,40.06 v46.35,40.06 | v41.09,41.89 40.69,42.28 40.01,42.28 39.4,42.89 38.55,42.89 35.28,46.17 35.28,47.4 34.08,48.6 33.14,48.6 32.47,49.27 32.47,49.87 32.6,50 33.44,50 33.63,49.81 36.99,49.81 37.57,50.39 37.57,51.21 36.39,52.39 30.84,52.39 29.25,50.8 J5.6
  Route15 0.15: v50.84,30.28 50.86,30.26 50.47,29.87 50.47,28.11 51.23,27.34 51.23,25.35 51.54,25.05 51.54,24.54 U2.A3 | v41.09,41.89 42.06,41.89 43.49,40.46 v43.52,40.46 | v47.18,37.38 47.18,37.52 47.38,37.71 47.38,39.03 v46.35,40.06
  Bottom 0.15: v50.84,30.28 49.5,31.62 49.5,32.02 47.18,34.33 v47.18,37.38
  other vias: 51.83,24.25
ARD_D18SDA  (via drill 0.2)
  Top 0.15: U7.21 52.03,31.51 52.8,30.73 54.3,30.73 55.13,29.91 U2.2 v55.14,28.99 | v40.55,47.02 40.36,47.2 40.36,47.4 39.78,47.98 35.32,47.98 v34.7,48.6 | J5.9 22.48,50.8 23.47,51.79 26.83,51.79 27.97,50.65 27.97,50.39 28.55,49.81 30.06,49.81 v30.88,48.99
  Route15 0.15: v40.55,47.02 40.55,46.84 40.67,46.71 40.67,44.96 41.09,44.55 42.81,44.55 43.49,43.86 44.15,43.86 44.45,44.16 46.79,44.16 46.85,44.09 52.85,44.09 53.16,44.41 53.64,44.41 53.8,44.25 v53.94,44.25
  Bottom 0.15: v53.94,44.25 53.94,42.42 55.34,41.02 55.34,36.81 54.65,36.12 54.65,35.62 54.85,35.42 54.85,29.28 v55.14,28.99 | v34.7,48.6 34.5,48.6 33.18,49.93 32.18,49.93 31.24,48.99 v30.88,48.99
ARD_D19SCL  (via drill 0.2)
  Top 0.15: U7.23 53.03,32.33 52.8,32.09 52.8,31.17 52.93,31.04 54.51,31.04 56.26,29.29 56.26,29.02 U2.1 v56.29,29 | v40.9,47.6 40.58,47.6 39.9,48.28 35.62,48.28 v35.4,48.5
  Route15 0.15: v55.23,44.26 55.2,44.29 54.5,44.29 54.09,44.71 53.03,44.71 52.72,44.4 51.3,44.4 51.06,44.64 49,44.64 48.79,44.43 46.94,44.43 46.61,44.76 46.16,44.76 46.13,44.73 45.31,44.73 45.07,44.97 43.72,44.97 43.61,44.85 43.25,44.85 43.16,44.95 42.59,44.95 42.49,44.85 41.47,44.85 40.98,45.34 40.98,47.19 40.9,47.27 v40.9,47.6
  Bottom 0.15: v55.23,44.26 55.23,43.74 56.5,42.48 56.5,41.07 56.26,40.83 56.26,36.66 56.39,36.54 56.39,36.19 56.26,36.06 56.26,34.96 56.01,34.71 56.01,29.28 v56.29,29 | v35.4,48.5 35.03,48.88 35.03,51.21 34.45,51.79 31.09,51.79 29.95,50.65 29.95,50.39 29.37,49.81 20.93,49.81 19.94,50.8 J5.10
ARD_PC6RESET
  Top 0.15: R24.2 15.32,7.08 15.31,7.08 15.18,6.94 15.18,5.83 16.27,4.72 16.27,2.61 18.06,0.82 24.93,0.82 25.48,1.37 25.48,2.17 27.26,3.95 31.61,3.95 J16.5
  Top 0.2: R23.2 R24.2
AREF
  Top 0.15: R42.1 24.25,50.8 J5.8
DGND  (via drill 0.2, 0.5)
  Top 0.15: 34.88,13.38 v35.2,13.7 | U8.44BOOT0 v38,11.58 v37.99,11.57 | R26.1 v9.42,35.02 | R25.1 v9.48,31 | R21.1 v9.46,28.51 v9.46,28.52 | J8.B1A12 v6.46,26.81 v6.46,26.82 | J2.A1B12 v6.5,18.2 | C32.2 v8.06,18.19 v8.06,18.18 | C34.2 v10.62,18.26 | R19.1 v8.96,16.3 | J2.B1A12 v6.44,11.78 | R20.1 v8.98,12.68 | C31.2 v8.96,14 | D2.1GND v10.88,14.1 | C9.2 v11.08,12 | R27.1 v8.96,9.5 | SW6.1 v1.52,4.76 | R29.1 v2,7.46 | C19.2 v4,7.46 | SW7.1 v6.52,4.73 v6.52,4.72 | R31.1 v7,7.44 | C20.2 v9,7.44 | SW8.1 v17,4.74 | R30.1 v19.5,7.44 | SW1.1 v22.02,4.74 | R28.1 v23.5,7.46 | J1.5GND v18.18,14.06 | C3.2 51.48,9.55 v51.46,9.57 | U2.10 v49.63,14.96 v49.62,14.95 | U2.H3 57.43,18.58 v57.45,18.56 | U2.H2 v57.44,20.86 | U2.H1 v57.44,23.13 | U2.C0 v55.42,21.25 | U2.B0 v55.43,22.76 | U2.A0 v55.45,24.25 | U2.H0 v57.45,25.38 | C63.2 v57.94,33.5 | C4.2 v58.45,35.02 | C75.2 v57.93,37.5 | C65.2 v57.95,40.49 | C10.2 v55.99,42.05 | OSC1.2GND v53.34,41.14 v53.34,41.13 | C62.2 v47.01,41.46 | C71.2 v44.94,37 v44.93,37.01 | C70.2 v44.94,38 v44.93,37.99 | C69.2 v44.95,39.01 | C68.2 v45.41,40.03 | C67.2 v45.41,41.01 | U10.4GND v40.86,24.73 | C21.2 v38.51,36.44 | C16.2 v39.98,39.44 | C11.2 v35.94,39.45 v35.94,39.44 | U6.1VSS v36.6,41.02 | U3.1VSS v32.78,41.03 | C17.2 v31.93,39.46 | C15.2 v39.03,44.44 | C14.2 v35.05,44.47 | C18.2 v31.04,44.46 | U4.1GND v21.61,45 v21.62,44.99 | C22.2 v22.58,47.48 | C13.2 v20.47,47.49 | J8.A1B12 v6.46,33.2 | C23.2 v54.21,31.51 | U7.PADDLE 50.78,36.18 v50.8,36.2 | C2.2 v43.4,42.56 | C12.2 v14.6,47.5
  Top 0.2: U8.EP 38.32,16.7 v39.2,16.7 | U8.EP 37.97,16.35 39.96,16.35 | U8.EP 35.02,17.86 35.02,18.29 | U8.EP 39.43,13.45 39.43,13.06 | C5.2 v32.39,11.69 | C8.2 v35.2,21.11
  Top 0.3: U8.35VSS 34.88,13.38 | 39.43,13.06 39.5,12.99 U8.47VSS | U8.8VSSA 39.99,16.38 39.96,16.35 | U8.23VSS 35,18.31 35.02,18.29 | C6.2 v43.12,16.87 | C7.2 v41.6,10.82 | OSC1.2GND 53.65,41.45 53.65,41.72 53.98,42.05 C10.2
  Top 0.8: 58.43,34.96 58.43,33.98 C63.2
  Top 1: 58.43,34.96 C4.2 | U4.1GND 20.38,43.84 v20.38,42.92 | U4.1GND 22.91,43.63 v22.91,42.82 | U4.1GND v25.33,45 v25.34,45.01
  Top 2: J6.1 3,38.13 J7.3GND
  Bottom 0.15: R41.1 53.51,44.38 53.51,44.43 54.04,44.95 v54.6,44.95 | T16.T 11.08,11.92 v11.08,12 | T23.T 44.26,16.87 v43.12,16.87
  other vias: 35.2,17.7 36.2,17.7 37.2,17.7 38.2,17.7 39.2,17.7 38.2,16.7 37.2,16.7 36.2,16.7 35.2,16.7 35.2,15.7 36.2,15.7 37.2,15.7 38.2,15.7 39.2,15.7 39.2,14.7 38.2,14.7 37.2,14.7 36.2,14.7 35.2,14.7 36.2,13.7 37.2,13.7 38.2,13.7 39.2,13.7 48.8,38.2 49.8,38.2 50.8,38.2 51.8,38.2 52.8,38.2 52.8,37.2 51.8,37.2 50.8,37.2 49.8,37.2 48.8,37.2 48.8,36.2 49.8,36.2 51.8,36.2 52.8,36.2 52.8,35.2 51.8,35.2 50.8,35.2 49.8,35.2 48.8,35.2 48.8,34.2 49.8,34.2 50.8,34.2 51.8,34.2 52.8,34.2 40.6,41.01 55.43,19.75 49.96,10.1 48.26,3.03 14.2,47.9 14.9,47.9 14.9,47.1 14.2,47.1
  pour gnd: 0,0 0,53 58,53 58,0
FLASHVCC
  Top 0.5: U10.8VCC 37,32.7 R34.1 37.4,35.55 C21.1
ICE_19  (via drill 0.2)
  Top 0.15: v44.57,28.18 44.05,27.66 44.05,27.49 43.8,27.24 43.45,27.24 42.69,28 v42.46,28 | v52.32,30.4 51.5,30.4 51,30.9 51,32.65 U7.19
  Bottom 0.15: J16.6 34.92,6.98 43.22,6.98 44.71,8.47 44.71,10.8 | v42.46,28 42.24,28.22 41.01,28.22 39.9,27.11 39.9,26.12 40.77,25.25 41.07,25.25 42.47,23.85 42.64,23.85 43.57,22.91 43.57,22.53 43.77,22.34 44.59,22.34 44.87,22.05 45.48,22.05 46.04,21.49 46.04,16.23 | v44.57,28.18 45.16,28.18 45.22,28.12 51.32,28.12 52.3,29.1 52.3,30.4 v52.32,30.4
  Bottom 0.152: 44.71,10.8 44.8,10.89 44.8,14.99 46.04,16.23
ICE_31  (via drill 0.2)
  Top 0.15: U7.31 54.37,36.52 55.41,36.52 55.59,36.7 v55.84,36.7
  Bottom 0.15: v55.84,36.7 55.84,36.88 55.86,36.9 55.86,41.58 54.8,42.63 54.8,44.44 55.09,44.72 55.09,45.1 54.29,45.9 53.52,45.9 J10.4
ICE_32  (via drill 0.2)
  Top 0.15: U7.32 55.35,36.88 56.7,38.23 57.24,38.23 57.62,38.61 57.62,39.64 57.76,39.77 58.24,39.77 58.63,40.16 v58.63,41.04
  Bottom 0.15: v58.63,41.04 58.63,43.39 J10.7
ICE_32MHZOSC
  Top 0.15: OSC1.3OUT 54.65,40.48 55.25,39.88 55.25,38.67 54.96,38.38 U7.35GBIN0
ICE_34
  Top 0.15: U7.34 54.37,38.02 55.02,38.02 55.55,38.55 55.55,40 56.82,41.27 58.18,41.27 59.02,42.12 59.02,43.89 59.86,44.73 61.37,44.73 62.36,45.72 J10.8
ICE_BTN  (via drill 0.2)
  Top 0.15: 43.31,41.68 46.36,41.68 46.75,42.07 | U7.48 48.03,40.46 47.65,40.84 | v48.55,43.42 47.98,42.84 | v9.68,7.48 10.87,7.48 R22.1
  Top 0.3: 43.31,41.68 v43.17,41.54 | 47.98,42.84 47.65,42.52 47.65,42.4 | 47.65,42.4 47.32,42.07 46.75,42.07 | 47.65,40.84 47.65,42.4
  Route15 0.15: J9.5 50.35,48.26 48.8,46.71 47.85,46.71 47.27,46.13 47.27,45.18 v47.24,45.16
  Bottom 0.15: v43.17,41.54 41.76,41.54 41.69,41.46 37.65,41.46 36.78,40.59 36.49,40.59 35.47,39.57 35.47,38.47 33.64,36.64 32.81,36.64 30.36,39.09 27.53,39.09 26.9,38.46 26.9,37.7 28.05,36.55 28.35,36.55 29.04,35.86 29.04,30.11 28.37,29.44 27.92,29.44 9.74,11.26 9.74,7.54 v9.68,7.48 | v48.55,43.42 47.94,44.03 47.67,44.03 47.24,44.46 v47.24,45.16
ICE_CDONE  (via drill 0.2)
  Top 0.15: U7.7CDONE 47.31,35.86 45.32,35.86 45.18,36 R14.1 44.95,35.98 44.08,35.12 43.83,34.87 43.83,34.65 v43.44,34.26 | v42.55,40.8 42.52,40.8 42.43,40.89 42.43,44.33 43.38,45.28 v43.43,45.28
  Route15 0.15: J9.3 47.27,47.27 44.44,47.27 43.43,46.26 v43.43,45.28
  Bottom 0.15: v43.44,34.26 43.44,34.46 43.31,34.58 43.31,34.98 40.57,37.72 40.39,37.72 40.13,37.98 40.13,38.87 42.11,40.85 42.5,40.85 v42.55,40.8
ICE_CRESETB  (via drill 0.2)
  Top 0.15: U2.A6 47.64,24.84 47.64,26.6 46.52,27.72 46.52,31.51 45.74,32.29 45.74,34.14 | 45.48,34.34 45.48,34.95 45.92,35.38 U7.8CRESETB | v42.15,28.79 42.5,28.79 v43.62,27.67 | v19.04,8.93 20.23,8.93 20.51,8.65 v20.51,6.56 20.51,5.26 SW8.2 | v41.53,34.96 41.4,34.96 41.4,39.97 41.83,40.39 41.83,47.21 42.87,48.26 J9.1 | v43.62,33.7 44.35,33.7 44.57,33.92 | 17.7,7.1 16.9,7.1 16.35,6.55 R24.1
  Top 0.2: 45.48,34.34 45.61,34.21 | R9.1 18.25,6.55 17.7,7.1
  Top 0.3: 45.74,34.14 45.64,34.24 45.61,34.21 45.32,33.92 44.57,33.92
  Route15 0.15: R9.1 v20.51,6.56
  Bottom 0.15: U2.A6 46.39,26.09 45.2,26.09 v43.62,27.67 | v42.15,28.79 41.16,28.79 39.64,27.27 34.39,27.27 33.85,26.73 31.5,26.73 31.16,26.39 30.14,26.39 30.1,26.44 25.76,26.44 15.45,16.13 15.45,15.44 15.14,15.13 15.14,14.21 15.79,13.56 15.79,11.95 16.56,11.18 16.56,10 17.63,8.93 v19.04,8.93 | v41.53,34.96 41.53,34.56 42.38,33.71 42.84,33.71 42.96,33.83 43.48,33.83 v43.62,33.7
  other vias: 48.23,24.25 18.5,6.55
ICE_FLASHWPN  (via drill 0.2)
  Top 0.15: U10.3WPNIO2 39.62,22.57 R4.1 41.42,22.45 v46.46,17.41 | U2.F3 51.3,16.22 49.21,16.22 49.21,16.23 47.74,16.23 v47.44,16.53
  Route15 0.15: v47.44,16.53 47.34,16.53 v46.46,17.41
ICE_HOLDN
  Top 0.15: U10.7HOLDNIO3 38.34,33.52 38.89,34.06 41.12,34.06 41.51,33.67 41.51,32.31 47.34,26.48 47.34,24.4 48.16,23.57 49.77,23.57 50.02,23.32 50.52,23.32 50.67,23.47 50.67,24.21 U2.A4
ICE_LEDB  (via drill 0.2)
  Top 0.15: U7.46 49.03,40.54 48.52,41.05 R2.1 v48.49,41.03
  gnd 0.15: v50.64,43.37 50.64,44.48 49.81,45.31 49.81,46.13 50.39,46.71 50.7,46.71 52.25,48.26 J9.7
  Bottom 0.15: v48.49,41.03 48.49,41.25 50.61,43.37 v50.64,43.37
ICE_LEDG  (via drill 0.2)
  Top 0.15: U7.45 49.53,41.02 R3.1 v49.5,41.06
  gnd 0.15: v49.5,41.06 49.5,41.63 51.07,43.19 51.07,44.37 51.79,45.09 51.79,46.13 51.76,46.16 51.76,46.55 52.48,47.27 53.75,47.27 54.74,48.26 J9.9
ICE_LEDR  (via drill 0.2)
  Top 0.15: U7.44GBIN6 50.03,40.58 R1.1 v50.51,41.07
  gnd 0.15: v50.51,41.07 50.51,42.21 51.37,43.07 51.37,44.24 52.09,44.97 52.09,46.46 52.6,46.97 53.87,46.97 54.18,47.28 55.46,47.28 55.47,47.27 56.29,47.27 57.28,48.26 J9.11
ICE_RGB0  (via drill 0.2)
  Top 0.15: U7.41RGB0 v51.53,39.95 v51.54,39.96
  Route15 0.15: v51.54,39.96 51.06,40.44 51.06,42.18 49.91,43.33 49.06,43.33 48.73,42.99 48.37,42.99 47.94,43.43 v47.85,43.43
  Bottom 0.15: v47.85,43.43 45.72,45.56 J10.1
ICE_RGB1  (via drill 0.2)
  Top 0.15: U7.40RGB1 v52.03,40.23 | v52.52,44.82 52.84,44.82 52.93,44.73 53.75,44.73 54.33,45.31 54.33,45.57 56.03,47.27 56.29,47.27 57.43,48.41 57.43,48.67 58.01,49.25 61.37,49.25 62.36,48.26 J9.15
  gnd 0.15: v52.03,40.23 51.96,40.3 51.96,40.77 51.71,41.02 51.6,41.02 51.24,41.38 51.24,42.52 51.67,42.95 51.67,44.12 52.37,44.82 v52.52,44.82
ICE_RGB2  (via drill 0.2)
  Top 0.15: U7.39RGB2 v52.53,39.96
  Route15 0.15: v52.53,39.96 52.53,40.08 52.95,40.5 52.95,40.86 52.91,40.9 52.91,41.42 54.01,42.52 59.78,42.52 62.21,44.95 62.21,47.43 61.38,48.26 J9.13
ICE_SCK  (via drill 0.2)
  Top 0.15: U7.15SPISCK 49.07,32.64 v49.07,31.84 | 39.62,32.51 U10.6SCK | v53.04,22.75 U2.B2 52.07,21.79 47.47,21.79 44.91,24.35 44.91,24.38 41.71,27.58 41.71,29.06 39.62,31.16 39.62,31.14 38.24,29.76 38.1,29.76 37.24,28.9 37.24,28.76 34.01,25.53
  Top 0.3: 39.62,31.16 39.62,32.51 | J14.3 33.15,25.53 34.01,25.53
  Route15 0.15: v53.04,22.75 52.51,22.75 50.63,24.63 50.63,27.1 49.73,28 49.73,31.36 49.25,31.84 v49.07,31.84
ICE_SDI  (via drill 0.2)
  Top 0.15: v51.11,24.87 51.09,24.87 51.3,24.66 51.3,23.13 50.92,22.75 U2.B4 50.17,22.75 49.65,23.27 48.04,23.27 47.02,24.29 47.02,26.35 42.23,31.14 41.32,31.14 40.88,31.57 U10.5SIIO0 v40.9,32.62 v40.9,32.61 | 33.59,31.08 38.42,31.08 38.65,30.85 v38.65,30.77 | v48.46,31.6 48.53,31.67 U7.14SPISO
  Top 1: J14.1 33.59,31.05 33.59,31.08
  Route15 0.15: v51.11,24.87 50.93,25.05 50.93,27.22 50.03,28.12 50.03,30.07 v50.16,30.2
  Bottom 0.15: v38.65,30.77 39.06,30.77 v40.9,32.61 | v50.16,30.2 49.73,30.63 49.73,30.78 49.48,31.03 48.97,31.03 48.46,31.54 v48.46,31.6
ICE_SDO  (via drill 0.2)
  Top 0.15: U2.B3 51.17,22.09 47.59,22.09 45.21,24.47 45.21,25.37 44.62,25.96 44.22,25.96 44.1,26.08 v43.92,26.08 | v42.45,25.2 42.13,25.2 41.31,26.03 38.46,26.03 38.34,25.91 U10.2SOIO1 38.34,23.64 37.84,23.12 | v49.3,30.6 49.3,30.83 49.85,31.38 49.85,31.65 50.03,31.83 U7.17SPISI
  Top 0.3: 37.84,23.12 37.66,22.95 34.02,22.95 33.93,22.86 J14.4
  Route15 0.15: v43.92,26.08 43.4,25.56 43.23,25.56 42.87,25.2 v42.45,25.2 | U2.B3 51.69,22.89 51.69,23.14 50.33,24.5 50.33,26.97 49.43,27.87 49.43,30.47 v49.3,30.6
  other vias: 51.83,22.75
ICE_SSB  (via drill 0.2)
  Top 0.15: v42.45,27.44 43.35,26.54 44.06,26.54 44.35,26.26 44.74,26.26 45.6,25.4 45.6,24.53 46.3,23.84 46.3,23.81 47.36,22.75 U2.B6 | U10.1CSN 37.08,26.5 37.88,27.3 40.07,27.3 v40.42,26.95 | U7.16SPISS 49.53,32.59 49.55,32.57 49.55,31.5 48.82,30.77 v48.82,30.28 | 33.12,27.48 32,26.36 32,24.79 32.46,24.33 36.67,24.33 U10.1CSN | R37.2 v36.57,21.42 | U10.1CSN 37.09,24.71 v37.09,24.7
  Top 0.3: J14.2 33.12,27.84 33.12,27.48
  Route15 0.15: v48.82,30.28 v48.81,30.27 48.81,30.22 49.13,29.9 49.13,27.4 48.96,27.23 48.96,23.48 U2.B6
  Bottom 0.15: v42.45,27.44 42.35,27.34 40.81,27.34 v40.42,26.95 | v36.57,21.42 36.57,24.18 v37.09,24.7
  other vias: 48.23,22.75
ICE_VCC  (via drill 0.2, 0.5)
  Top 0.15: 55.17,35.89 55.23,35.89 v55.25,35.87 | R16.1 45.15,42.9
  Top 0.2: C68.1 v44.51,40.03 | C67.1 v44.51,41.03
  Top 0.3: U7.30VCC 55.16,35.88 55.17,35.89 | v46.12,36.89 46.14,36.87 U7.5VCC
  Top 0.5: C71.1 v44.04,37 | C70.1 v44.04,38 | 45.15,42.9 v44.49,42.24
  Route15 0.2: 44.47,37.47 45.43,37.47 45.44,37.46 | v44.04,37 44.04,37.06
  Route15 0.3: v44.04,37 44.51,37.47
  Route15 0.5: v44.49,42.24 44.51,42.22 v44.51,41.03 v44.51,40.03 44.51,39.46 C69.1 C70.1 v44.04,38 44.04,37.06 | 44.51,37.47 44.47,37.47 | 45.44,37.46 46.01,36.89 46.08,36.89
  Route15 1: v55.25,35.87 53.65,34.27 53.65,33.85 53.15,33.35 48.45,33.35 47.95,33.85 47.95,35.01 46.08,36.88 46.08,36.89 v46.12,36.89
  other vias: 44.05,39
  pour Route15: 43.5,42.1 43.9,42.1 44.8,42.3 45.5,42.3 46.8,41 46.8,36.7 46.3,36.2 44,36.2 43.2,37 43.2,38 43,38.2 43,41.6
ICE_VCCIO0
  Top 0.15: C65.1 57.05,39.4 R36.1
  Top 0.3: R36.1 55.71,38.06 55.71,37.79 55.3,37.38 U7.33VCCIO0
ICE_VCCIO1  (via drill 0.2, 0.3)
  Top 0.15: v19.13,8.22 18.5,7.59 R9.2 | U7.22SPIVCCIO1 v52.53,32.43 | R14.2 v44.04,36.01 v44.04,36.02
  Top 0.2: C63.1 56.65,33.1 R35.1 v56.67,32.03
  Top 0.3: v43.97,28.72 43.1,28.72 42.66,29.16 42.56,29.16 42.02,29.71 v41.95,29.71 | v38.38,27.93 38.13,27.67 37.72,27.67 36.18,26.13 v36.2,26.1
  Route15 0.3: v41.95,29.71 41.95,30.07 38.01,34.01 38.01,36.65 38.3,36.94 41.88,36.94 42.8,36.02 v44.04,36.02
  Route15 0.5: v52.53,32.43 56.27,32.43 v56.67,32.03
  Bottom 0.15: 18.61,14.73 18.61,13.88 18.18,13.46 18.18,10.56 19.54,9.2 19.54,8.61 v19.14,8.21 v19.13,8.22
  Bottom 0.3: v43.97,28.72 v43.98,28.71 45.38,28.71 45.55,28.54 50.08,28.54 51.82,30.28 51.82,30.61 52.6,31.39 52.6,32.36 v52.53,32.43 | v41.95,29.71 40.3,29.71 38.45,27.86 v38.38,27.93 | v36.2,26.1 35.77,25.67 35.77,23.41 35.45,23.09 34.99,23.09 34.79,23.09 33.18,21.48 29.58,21.48 26.14,18.04 21.92,18.04 18.61,14.73
ICE_VCCIO2  (via drill 0.2, 0.3)
  Top 0.15: U7.1VCCIO2 47.33,40.22 C62.1 v47,40.57 | R15.2 11.19,10.64 14.02,10.64 15.61,12.23 v15.61,14.93 v15.62,14.93
  Top 0.5: v33.44,37.12 35.63,34.93 v35.63,32.16 v35.62,32.16
  Route15 0.5: v35.45,28.5 35.45,23.89 v35.21,23.65 v35.22,23.64
  Bottom 0.15: v15.62,14.93 26.09,25.4
  Bottom 0.5: v47,40.57 46.7,40.57 45.09,42.18 45.09,42.49 44.06,43.52 40.38,43.52 40.03,43.17 40.03,43 39.68,42.65 37.57,42.65 37.09,42.17 36.56,42.17 33.42,39.03 33.42,37.12 v33.44,37.12 | v35.62,32.16 35.62,28.63 35.47,28.48 v35.45,28.5 | v35.22,23.64 34.19,23.64 33.62,24.2 29.14,24.2
  Bottom 1: 26.09,25.4 J4.2 29.14,24.2
ICE_XTALEN  (via drill 0.2)
  Top 0.15: T13.1 63.5,44.32 64.49,45.31 64.49,46.13 63.91,46.71 60.55,46.71 59.97,46.13 59.97,45.58 59.29,44.9 59,44.9 58.56,44.46 56.68,44.46 56.05,43.83 54.33,43.83 OSC1.1OESTN 53.35,42.95 v52.75,43.55 52.6,43.55 R13.1
  Bottom 0.15: R41.2 52.75,43.76 v52.75,43.55
JLINK_SWO
  Top 0.2: J1.6SWO 18.03,12.65 18.03,11.94 16.6,10.5 15.68,10.5 14.88,9.7 T11.T
N$1
  Top 0.15: U5.1BLUE 51.67,4.67 51.79,4.67 52.1,4.98 52.1,5.6 52.6,6.1 53.25,6.1 53.6,6.45
  Top 0.2: 53.6,6.45 R5.2
N$2
  Top 0.2: U5.2GREEN 51.6,5.95 R6.2
N$3
  Top 0.2: U5.3RED 51,6.35 R7.2
N$4
  Top 0.2: R1.2 50.08,42.38 U1.3RED
N$5
  Top 0.2: R3.2 49.48,41.98 U1.2GREEN
N$6
  Top 0.2: U1.1BLUE 49.38,43.81 49.33,43.76 49.27,43.76 49.02,43.52 49.02,42.48 R2.2
N$7
  Top 0.2: U8.12PA2 41.43,18.38 R11.2
N$8
  Top 0.2: C10.1 55.9,42.85
  Top 0.3: 55.9,42.85 OSC1.4VCC | R12.1 56.59,42.95 C10.1
N$9
  Top 0.15: C20.1 R22.2
  Top 0.2: SW7.2 9.5,6.05 C20.1 R15.1
N$10
  Top 0.15: R10.1 44.11,10.84 D5.C
N$11
  Top 0.15: SW6.2 4.48,4.77 4.48,5.76 5,6.28 R8.2 C19.1 R18.1
N$12
  Top 0.2: SW7.S 8,5.55 R31.2
N$13
  Top 0.2: SW1.S R28.2
N$14
  Top 0.2: SW6.S 3,5.55 R29.2
N$15  (via drill 0.2)
  Top 0.15: R38.1 50.95,4.55 U5.4ANODE | R38.1 v49.72,4.56 | C1.1 48.88,4.55 R38.1
  Route15 0.15: v49.72,4.56 47.67,4.56 45.51,6.72 41.06,6.72 40.45,7.33 40.45,7.42 39.81,8.05 38.94,8.05 J3.4
N$16
  Top 0.15: 18.5,3.95 18.5,5.55 R30.2
  Top 0.2: SW8.S 18.5,3.95
N$17  (via drill 0.2)
  Top 0.3: C2.1 43.98,44.02 | 43.98,44.02 44.13,44.18 49.02,44.18 49.15,44.31 49.8,44.31 49.98,44.14 49.98,43.91 U1.4ANODE | v43.67,44.29 43.94,44.02 43.98,44.02 | R39.1 40.82,43.75 39.83,43.75 39.65,43.57 38.98,43.57 v38.73,43.32
  Bottom 0.15: v38.73,43.32 39.52,44.11 39.52,44.64 39.82,44.93 42.54,44.93 42.92,44.55 43.41,44.55 v43.67,44.29
NRF_AIN0  (via drill 0.2)
  Top 0.15: v57.46,26.64 57.17,26.35 56.59,26.35 56.45,26.21 56.45,17.79 56.59,17.65 57.51,17.65 58.18,16.98 58.18,7.8 58.64,7.34 | v54.74,27.71 52.45,27.71 51.83,28.33 U2.5
  Top 0.3: 58.64,7.34 63.44,2.54 J11.6
  Route15 0.15: v57.46,26.64 56.39,27.71 v54.74,27.71
NRF_AIN1  (via drill 0.2)
  Top 0.15: 60.24,3.26 60.24,5 57.88,7.36 57.88,16.86 57.39,17.35 56.46,17.35 56.15,17.67 56.15,26.18 v56.02,26.3 | U2.6 50.88,28.85 50.88,28.14 51.19,27.83 51.63,27.83 v51.67,27.87
  Top 0.3: 60.24,3.26 J11.5
  Route15 0.15: v56.02,26.3 56.02,26.59 55.33,27.28 54.56,27.28 54.31,27.53 54.31,27.55 53.99,27.87 v51.67,27.87
NRF_AIN2
  Top 0.15: 56.35,7.49 57.28,8.42 57.28,16.51 57.04,16.75 54.99,16.75 53.7,18.03 53.7,22.97 54.23,23.49 U2.A1
  Top 0.3: 56.35,7.49 56.35,3.01 J11.3
NRF_AIN3
  Top 0.15: 58.39,5.99 57.58,6.8 57.58,16.73 57.26,17.05 55.89,17.05 54.9,18.04 54.9,24.54 54.66,24.77 53.55,24.77 U2.A2
  Top 0.3: 58.39,5.99 58.39,2.57 J11.4
NRF_AIN4  (via drill 0.2)
  Top 0.15: U2.C6 46.29,21.25 44.55,22.99 44.55,23.01 44.48,23.09 44.48,24.04 40.03,28.48 38.35,28.48 38.3,28.54 37.92,28.54 v37.67,28.72 | v43.7,49.1 44.41,49.81 46.13,49.81 47.12,50.8 J9.4 | v29.7,37.1 v29.7,40.1
  Bottom 0.15: v43.7,49.1 43.24,49.1 40.14,46 37.66,46 37.36,45.7 35.7,45.7 35.3,45.3 30.2,45.3 29.4,44.5 29.4,40.4 v29.7,40.1 | v37.67,28.72 36.38,28.72 35.67,28 35.27,28 34.97,28.3 34.97,31.42 33.2,33.19 33.2,34.1 30.8,36.5 30.2,36.5 29.7,37 v29.7,37.1
NRF_AIN5  (via drill 0.2)
  Top 0.15: 52.06,3.8 53.43,3.8 55.28,5.65 55.28,7.73 56.68,9.13 56.68,13.58 v56.55,13.71
  Top 0.3: 52.06,3.8 J11.1
  Route15 0.15: v56.55,13.71 56.55,18.55 55.8,19.3 54.68,19.3 U2.D1
  other vias: 54.23,19.75
NRF_AIN6
  Top 0.15: 55.58,4.78 55.58,7.6 56.98,9 56.98,16.22 56.75,16.45 54.09,16.45 52.51,18.03 52.51,18.47 53.03,18.99 U2.D2
  Top 0.3: 55.58,4.78 J11.2
NRF_AIN7  (via drill 0.2)
  Route15 0.15: v57.29,44.89 56.87,45.31 56.87,46.13 56.29,46.71 56.03,46.71 54.33,48.41 54.33,48.67 53.7,49.3 v49,49.3
  Bottom 0.15: v57.29,44.89 57.13,44.73 57.13,44.11 56.8,43.78 56.8,40.95 56.56,40.71 56.56,36.79 56.69,36.66 56.69,36.06 56.56,35.94 56.56,34.83 56.31,34.58 56.31,32.99 57.1,32.21 57.1,31.85 57.02,31.77 57.02,26.28 55.88,25.14 55.88,21.1 55.29,20.51 52.18,20.51 51.83,20.16 U2.D3 | J9.2 46.92,49.6 48.7,49.6 v49,49.3
  other vias: 51.83,19.75
NRF_BTN  (via drill 0.2)
  Top 0.15: v41.58,5.94 41.18,5.94 41.05,6.07 29.68,6.07 25.58,10.18 15.81,10.18 13.62,7.99 13.62,7.46 10.22,4.05 10.22,2.61 8.79,1.18 7.21,1.18 6.97,1.18 5.6,2.55 5.6,6.87 5.39,7.08 5.38,7.08 R8.1
  Route15 0.15: U2.Z0 56.17,25.01 56.17,19.35 56.98,18.54 56.98,6.67 54.4,4.09 45.31,4.09 44.17,5.23 44.17,5.49 43.59,6.07 41.88,6.07 41.88,6.08 41.74,5.94 v41.58,5.94
  other vias: 55.43,25.75
NRF_CTS  (via drill 0.2)
  Top 0.15: v40.62,22.02 40.02,21.43 40.02,21.16 39.48,20.61 38.87,20.61 38,19.74 U8.17PA7 | U2.E3 51.28,18.8 48.08,18.8 47.7,19.18 46.01,19.18 43.97,21.22 43.97,22.68 v44.13,22.84 | v40.7,22.88 40.88,22.88 41.01,22.75 42.79,22.75 v42.94,22.91
  Route15 0.15: v40.62,22.02 40.6,22.04 40.6,22.78 v40.7,22.88 | v44.13,22.84 44.12,22.83 43.67,22.83 43.59,22.91 v42.94,22.91
NRF_DCOUT  (via drill 0.2)
  Top 0.15: U2.F5 v49.44,16.75
  Route15 0.15: v45.23,13.33 44.06,13.33 T2.1
  Bottom 0.15: v49.44,16.75 49.44,16.67 47.87,15.1 47.87,13.05 47.87,11.92 47.02,11.07 46.2,11.07 45.23,12.04 v45.23,13.33
NRF_LEDB  (via drill 0.2)
  Top 0.15: U2.B1 v54.23,22.76 | v55.24,13.18 55.24,13.04 54.65,12.46 54.65,9.3 R5.1 50.8,8.25 50.16,8.89 J3.1
  Route15 0.15: v55.24,13.18 55.24,14.47 55.65,14.88 55.65,16.74 54.57,17.82 54.05,17.82 53.78,18.1 53.78,19.9 54.05,20.18 54.27,20.18 54.84,20.75 54.84,22.15 v54.23,22.76
NRF_LEDG  (via drill 0.2)
  Top 0.15: v55.7,13.5 55.83,13.38 55.83,13.05 56.08,12.8 56.08,9.38 55.65,8.95 55.35,8.95 v54.45,8.05 | R6.1 v52.3,7.56
  Route15 0.15: v55.7,13.5 55.7,14.33 55.95,14.58 55.95,17.73 U2.E0 | J3.2 43.47,8.89 44.85,7.51 45.61,7.51 47.77,5.35 50.21,5.35 51.23,6.37 51.23,6.39 52.3,7.45 v52.3,7.56
  Bottom 0.15: v54.45,8.05 52.79,8.05 v52.3,7.56
  other vias: 55.43,18.25
NRF_LEDR  (via drill 0.2)
  Top 0.15: v56.25,13.23 56.38,13.1 56.38,9.25 54.12,7 54.12,6.51 53.41,5.8 53.15,5.8 v52.95,5.6 | J3.3 41.78,8.89 42.77,7.9 46.58,7.9 46.94,8.27 50.19,8.27 R7.1
  Route15 0.15: v56.25,13.23 56.25,13.41 56.13,13.53 56.13,13.89 56.25,14.01 56.25,18.42 55.68,19 54.98,19 U2.E1
  Bottom 0.15: v52.95,5.6 51.2,7.35 R7.1
  other vias: 54.23,18.25 51.1,7.35
NRF_RSTN  (via drill 0.2)
  Top 0.15: 20.92,9.85 21.77,9 v24.84,9 24.84,7.09 25.01,6.92 25.02,6.92 R17.1
  Top 0.2: R23.1 14.15,6.9 14.1,6.9 13.95,7.05 13.95,7.85 15.95,9.85 20.92,9.85 | U2.14 54.03,13.61 53.49,13.07 47.88,13.07 47.28,13.67 47.29,13.67 v47.33,13.63 | v45.07,15.87 45.07,16.78 43.97,17.88 U8.11PA1 | SW1.2 25,6.15 R17.1
  Route15 0.2: v47.33,13.63 47.3,13.63 45.07,15.86 v45.07,15.87
  Bottom 0.15: 44.84,15.64 v45.07,15.87 | 44.5,15.3 44.5,11.02 44.41,10.93 44.41,8.6 43.1,7.29 35.41,7.29 34.82,7.88 27.75,7.88 26.63,9 v24.84,9
  Bottom 0.152: 44.5,15.3 44.84,15.64
NRF_RTS  (via drill 0.2)
  Top 0.15: v41.17,22.02 41.05,21.9 41.05,21.75 39.54,20.25 38.93,20.25 38.5,19.82 U8.16PA6 | U2.13 52.93,13.91 52.44,13.42 48.24,13.42 47.58,14.08 47.58,14.86 47.44,15 v47.44,15.06
  Route15 0.15: v47.44,15.06 46.03,16.47 46.03,18.19 42.17,22.05 41.15,22.05 v41.17,22.02 41.18,22.03 v41.18,23.18
NRF_RXD  (via drill 0.2)
  Top 0.15: U8.31PA10 32.07,15.38 31.21,16.24 31.21,17.31 | 31.21,17.31 31.21,20.99 31.97,21.75 33.35,21.75 34.18,22.58 38.43,22.58 v38.51,22.66 | v44.41,21.91 46.04,20.27 48.45,20.27 48.97,19.75 U2.D5 | v30.49,17.33 31.19,17.33 31.21,17.31
  Bottom 0.15: v38.51,22.66 40.31,22.66 40.52,22.45 42.91,22.45 43.55,21.81 44.31,21.81 v44.41,21.91 | T19.T 30.49,17.06 v30.49,17.33
NRF_SPIDCN  (via drill 0.2, 0.3)
  Top 0.15: U2.12 v51.85,14.98
  Route15 0.15: v47.43,9.47 46.84,10.06 39.04,10.06 38.75,10.35 v38.75,10.73
  Bottom 0.15: v51.85,14.98 51.85,14.45 49.71,12.32 49.41,12.32 48.33,11.24 48.33,10.03 47.77,9.47 v47.43,9.47 | v38.75,10.73 38.92,10.73 T3.1
NRF_SWDCLK  (via drill 0.2, 0.5)
  Top 0.15: v42.4,19.73 42.93,19.2 R11.1
  Top 0.2: U2.15 55.13,14.21 53.63,12.71 47.6,12.71 v47.44,12.87 | R11.1 42.93,18.45 43.15,18.23 44.12,18.23 45.52,16.82 45.52,14.29 45.53,14.28 v45.53,14.26
  Bottom 0.15: v45.53,14.26 46.92,12.87 v47.44,12.87 | T18.T 41.27,19.73 v42.4,19.73
NRF_SWDIO  (via drill 0.2, 0.5)
  Top 0.15: 46.17,16.84 46.17,13.17 v45.91,12.91
  Top 0.2: U2.16 56.11,14.88 56.11,14.26 55.85,14 55.41,14 53.77,12.36 47.7,12.36 v47.37,12.03 | U8.14PA4 39.5,19.28 40.92,20.7 42.31,20.7 v43.83,19.18 46.17,16.84
  Bottom 0.15: v45.91,12.91 46.79,12.03 v47.37,12.03 | T17.T 43.84,19.18 v43.83,19.18
NRF_TXD  (via drill 0.2)